# EAGLE design Layer 3 (EAGLE 9.6.2)

## Sheet 1 of 5
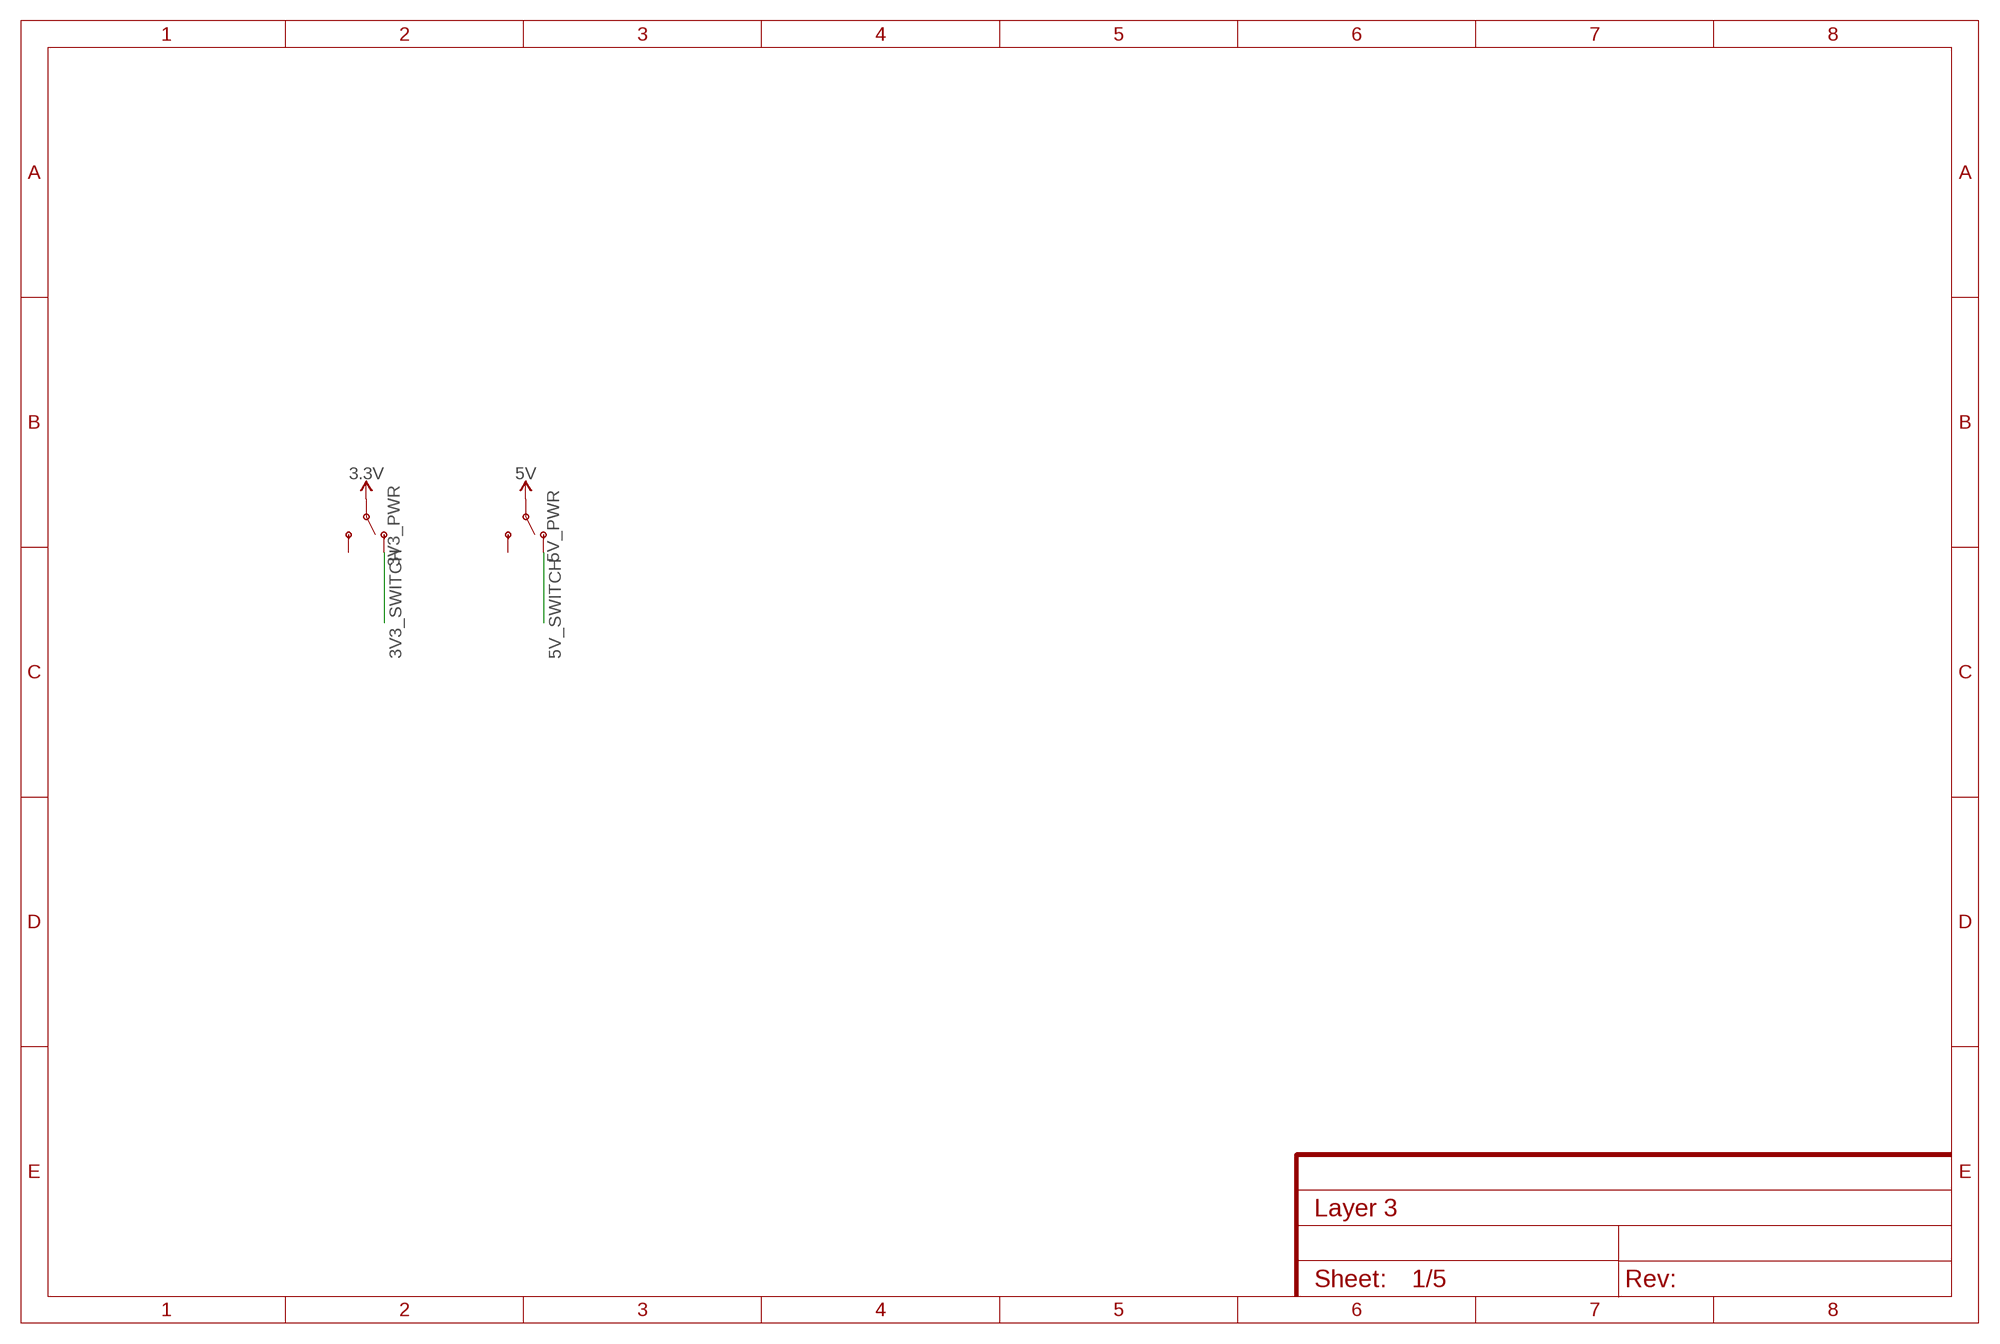
[diagram p0: schematic, sheet 1]

### Parts
3V3_PWR  SWITCH-SPDT-PTH-11.6X4.0MM-LOCK  [SWITCH_SPDT_PTH_11.6X4.0MM_LOCK]
5V_PWR  SWITCH-SPDT-PTH-11.6X4.0MM-LOCK  [SWITCH_SPDT_PTH_11.6X4.0MM_LOCK]

### Nets
3.3V: 3V3_PWR.2(P) ; also sheet 4,5
3V3_SWITCH: 3V3_PWR.1(O) ; also sheet 2,3,4
5V: 5V_PWR.2(P) ; also sheet 4,5
5V_SWITCH: 5V_PWR.1(O) ; also sheet 4
Unconnected: 3V3_PWR.3(S) 5V_PWR.3(S)

## Sheet 2 of 5
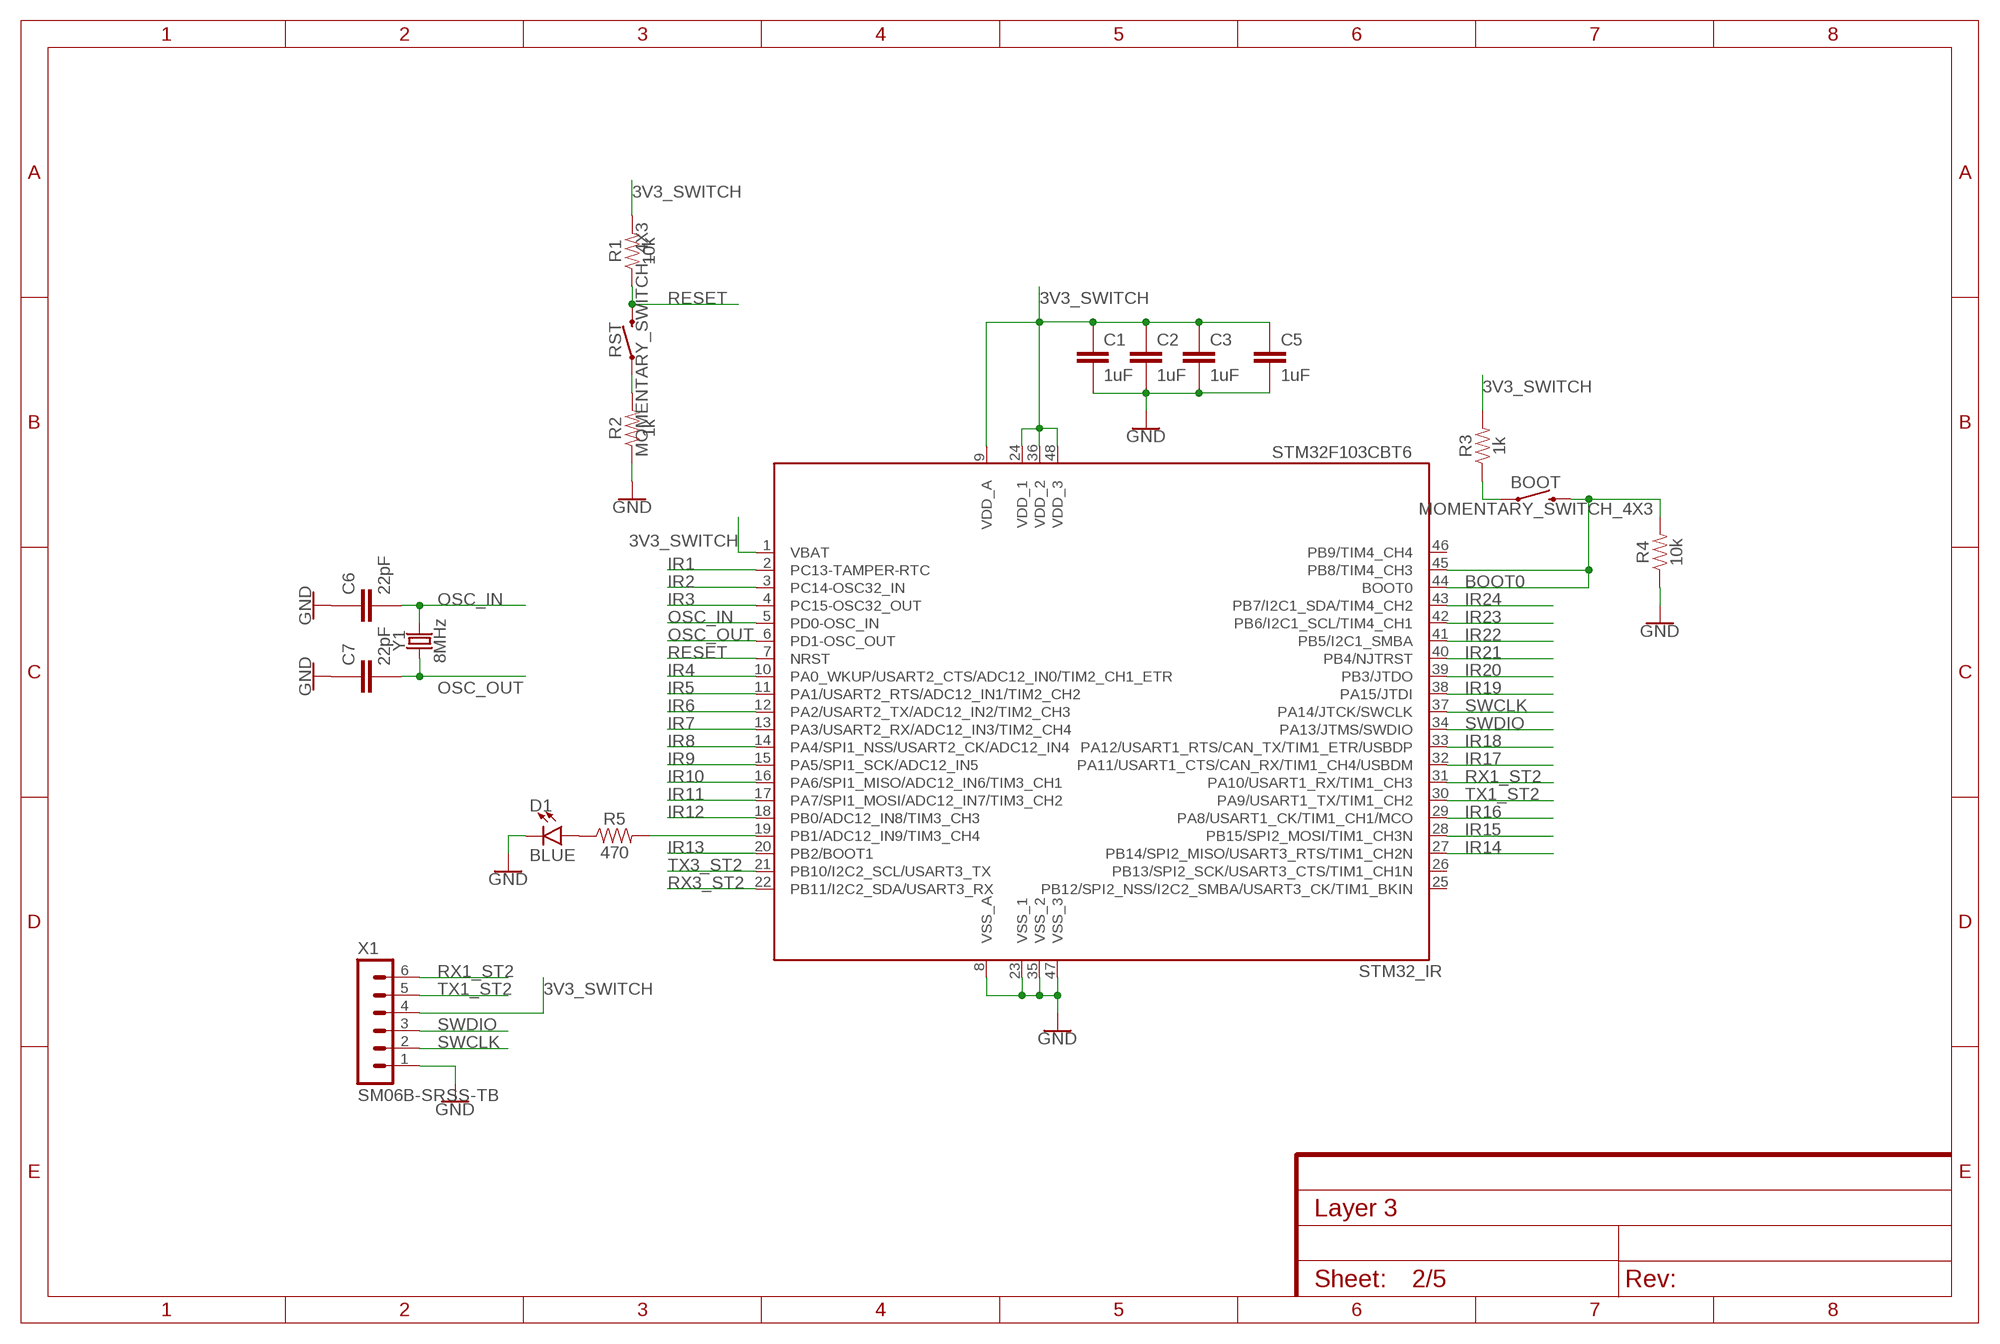
[diagram p1: schematic, sheet 2]

### Parts
BOOT  MOMENTARY_SWITCH_4X3  [MOMENTARY_SWITCH_4X3]
C1  1uF  CAPACITOR0603  [C0603]
C2  1uF  CAPACITOR0603  [C0603]
C3  1uF  CAPACITOR0603  [C0603]
C5  1uF  CAPACITOR0603  [C0603]
C6  22pF  CAPACITOR0603  [C0603]
C7  22pF  CAPACITOR0603  [C0603]
D1  BLUE  LED0603  [LED-0603]
R1  10k  RESISTOR0603  [R0603]
R2  1k  RESISTOR0603  [R0603]
R3  1k  RESISTOR0603  [R0603]
R4  10k  RESISTOR0603  [R0603]
R5  470  RESISTOR0603  [R0603]
RST  MOMENTARY_SWITCH_4X3  [MOMENTARY_SWITCH_4X3]
STM32_IR  STM32F103CBT6  [LQFP48]
X1  SM06B-SRSS-TB  [SM06B-SRSS-TB]
Y1  8MHz  CRYSTALSMD-5X3.2-2PAD  [CRYSTAL-SMD-5X3.2-2PAD]

### Nets
3V3_SWITCH: C1.1 C2.1 C3.1 C5.2 R1.2 R3.2 STM32_IR.1(VBAT) STM32_IR.9(VDD_A) STM32_IR.24(VDD_1) STM32_IR.36(VDD_2) STM32_IR.48(VDD_3) X1.4 ; also sheet 1,3,4
BOOT0: BOOT.P$2 R4.2 STM32_IR.44(BOOT0) STM32_IR.45(PB8/TIM4_CH3)
GND: C1.2 C2.2 C3.2 C5.1 C6.1 C7.1 D1.C R2.1 R4.1 STM32_IR.8(VSS_A) STM32_IR.23(VSS_1) STM32_IR.35(VSS_2) STM32_IR.47(VSS_3) X1.1 ; also sheet 3,4,5
IR1: STM32_IR.2(PC13-TAMPER-RTC) ; also sheet 3
IR2: STM32_IR.3(PC14-OSC32_IN) ; also sheet 3
IR3: STM32_IR.4(PC15-OSC32_OUT) ; also sheet 3
IR4: STM32_IR.10(PA0_WKUP/USART2_CTS/ADC12_IN0/TIM2_CH1_ETR) ; also sheet 3
IR5: STM32_IR.11(PA1/USART2_RTS/ADC12_IN1/TIM2_CH2) ; also sheet 3
IR6: STM32_IR.12(PA2/USART2_TX/ADC12_IN2/TIM2_CH3) ; also sheet 3
IR7: STM32_IR.13(PA3/USART2_RX/ADC12_IN3/TIM2_CH4) ; also sheet 3
IR8: STM32_IR.14(PA4/SPI1_NSS/USART2_CK/ADC12_IN4) ; also sheet 3
IR9: STM32_IR.15(PA5/SPI1_SCK/ADC12_IN5) ; also sheet 3
IR10: STM32_IR.16(PA6/SPI1_MISO/ADC12_IN6/TIM3_CH1) ; also sheet 3
IR11: STM32_IR.17(PA7/SPI1_MOSI/ADC12_IN7/TIM3_CH2) ; also sheet 3
IR12: STM32_IR.18(PB0/ADC12_IN8/TIM3_CH3) ; also sheet 3
IR13: STM32_IR.20(PB2/BOOT1) ; also sheet 3
IR14: STM32_IR.27(PB14/SPI2_MISO/USART3_RTS/TIM1_CH2N) ; also sheet 3
IR15: STM32_IR.28(PB15/SPI2_MOSI/TIM1_CH3N) ; also sheet 3
IR16: STM32_IR.29(PA8/USART1_CK/TIM1_CH1/MCO) ; also sheet 3
IR17: STM32_IR.32(PA11/USART1_CTS/CAN_RX/TIM1_CH4/USBDM) ; also sheet 3
IR18: STM32_IR.33(PA12/USART1_RTS/CAN_TX/TIM1_ETR/USBDP) ; also sheet 3
IR19: STM32_IR.38(PA15/JTDI) ; also sheet 3
IR20: STM32_IR.39(PB3/JTDO) ; also sheet 3
IR21: STM32_IR.40(PB4/NJTRST) ; also sheet 3
IR22: STM32_IR.41(PB5/I2C1_SMBA) ; also sheet 3
IR23: STM32_IR.42(PB6/I2C1_SCL/TIM4_CH1) ; also sheet 3
IR24: STM32_IR.43(PB7/I2C1_SDA/TIM4_CH2) ; also sheet 3
N$70: R2.2 RST.P$1
N$72: BOOT.P$1 R3.1
N$73: R5.2 STM32_IR.19(PB1/ADC12_IN9/TIM3_CH4)
N$74: D1.A R5.1
OSC_IN: C6.2 STM32_IR.5(PD0-OSC_IN) Y1.P$2
OSC_OUT: C7.2 STM32_IR.6(PD1-OSC_OUT) Y1.P$1
RESET: R1.1 RST.P$2 STM32_IR.7(NRST)
RX1_ST2: STM32_IR.31(PA10/USART1_RX/TIM1_CH3) X1.6 ; also sheet 4
RX3_ST2: STM32_IR.22(PB11/I2C2_SDA/USART3_RX)
SWCLK: STM32_IR.37(PA14/JTCK/SWCLK) X1.2
SWDIO: STM32_IR.34(PA13/JTMS/SWDIO) X1.3
TX1_ST2: STM32_IR.30(PA9/USART1_TX/TIM1_CH2) X1.5 ; also sheet 4
TX3_ST2: STM32_IR.21(PB10/I2C2_SCL/USART3_TX)
Unconnected: STM32_IR.25(PB12/SPI2_NSS/I2C2_SMBA/USART3_CK/TIM1_BKIN) STM32_IR.26(PB13/SPI2_SCK/USART3_CTS/TIM1_CH1N) STM32_IR.46(PB9/TIM4_CH4)

## Sheet 3 of 5
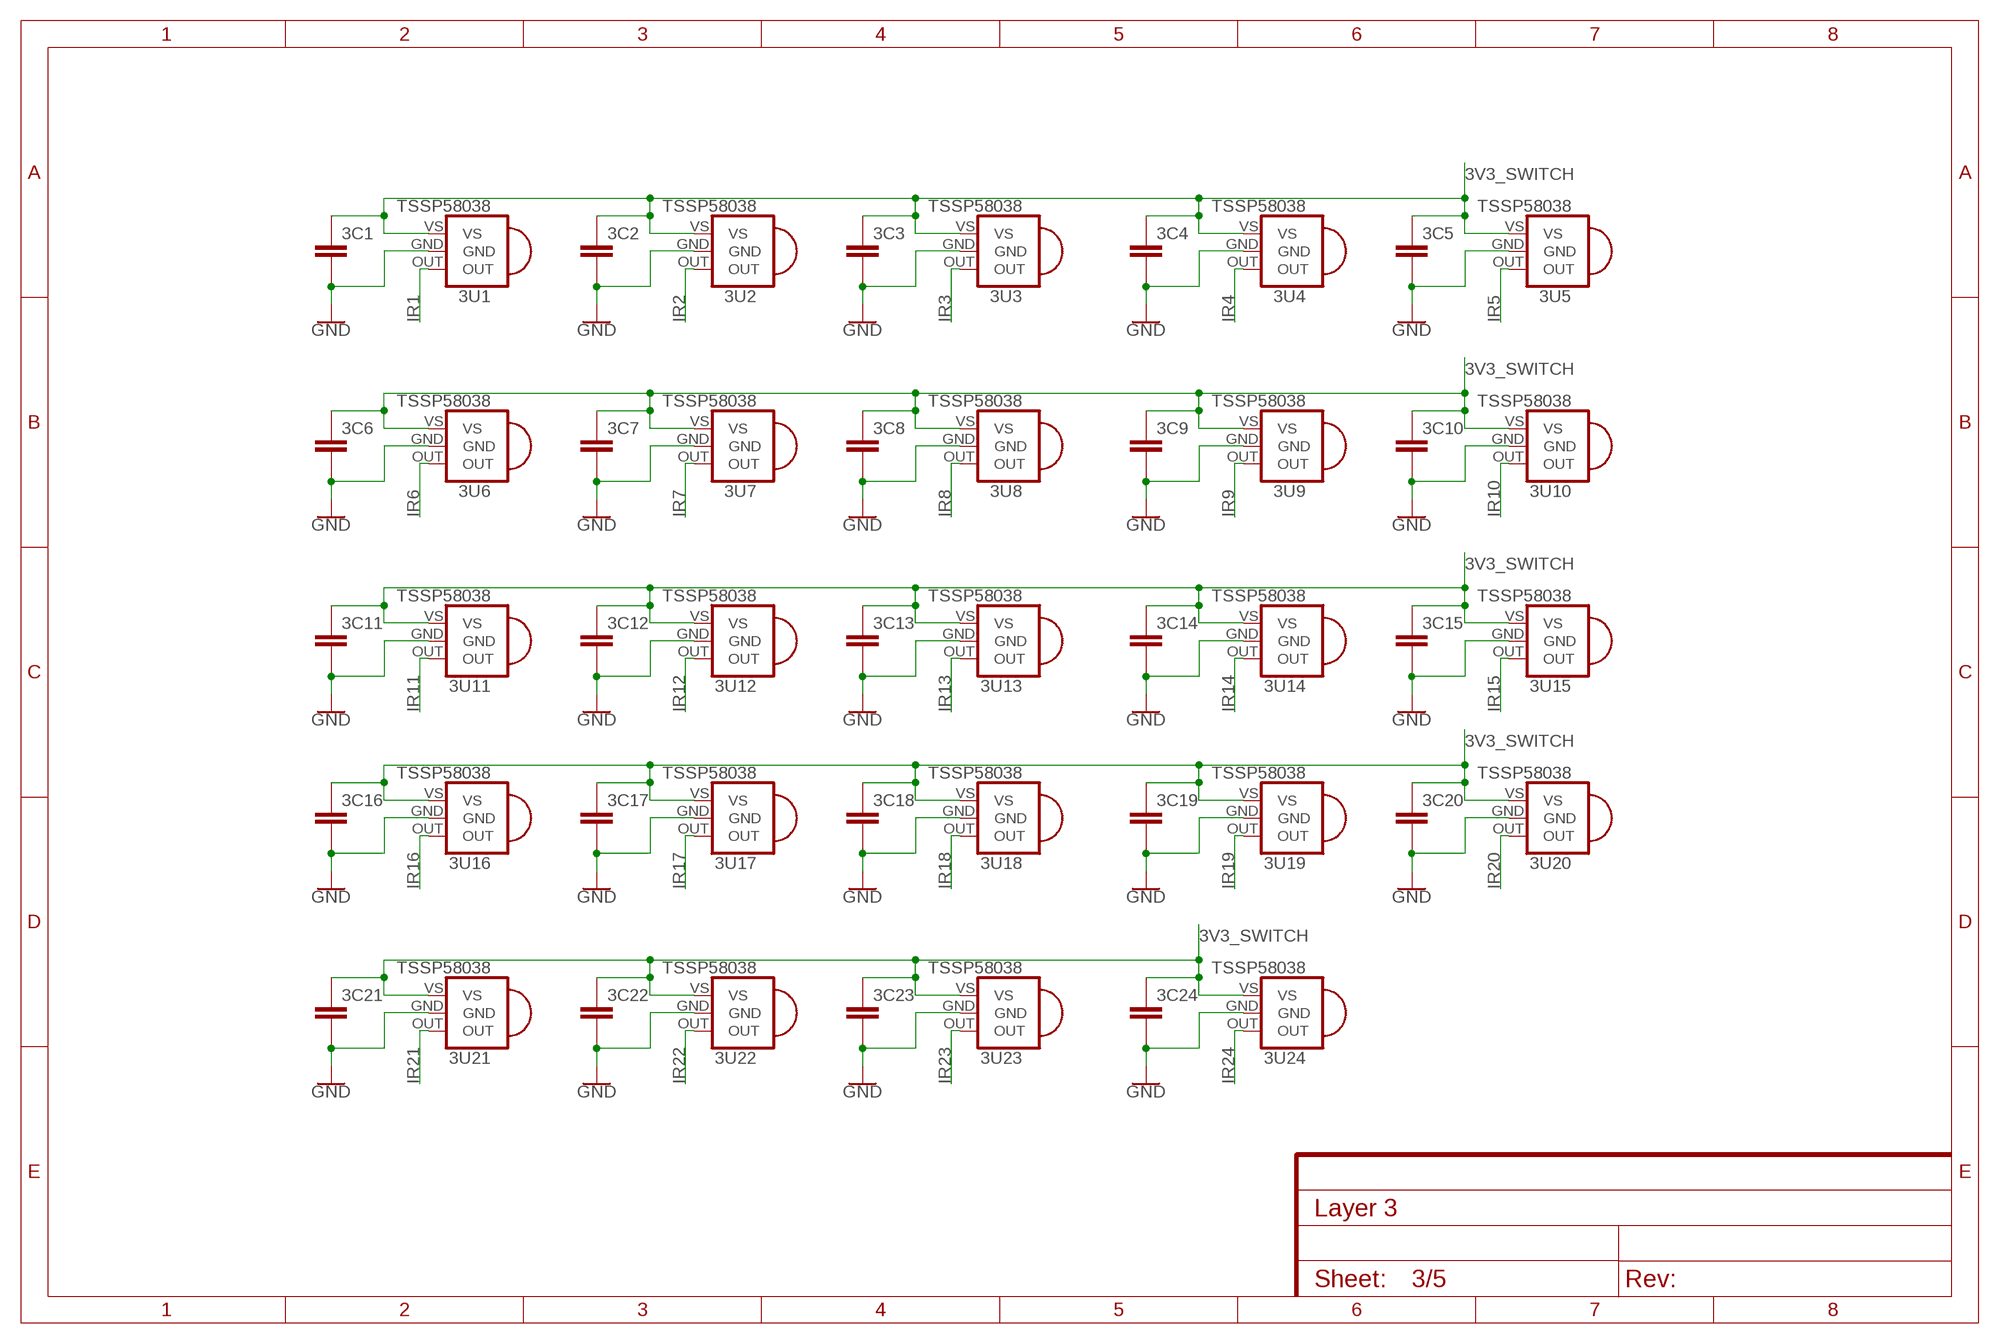
[diagram p2: schematic, sheet 3]

### Parts
3C1  CAPACITOR0603  [C0603]
3C2  CAPACITOR0603  [C0603]
3C3  CAPACITOR0603  [C0603]
3C4  CAPACITOR0603  [C0603]
3C5  CAPACITOR0603  [C0603]
3C6  CAPACITOR0603  [C0603]
3C7  CAPACITOR0603  [C0603]
3C8  CAPACITOR0603  [C0603]
3C9  CAPACITOR0603  [C0603]
3C10  CAPACITOR0603  [C0603]
3C11  CAPACITOR0603  [C0603]
3C12  CAPACITOR0603  [C0603]
3C13  CAPACITOR0603  [C0603]
3C14  CAPACITOR0603  [C0603]
3C15  CAPACITOR0603  [C0603]
3C16  CAPACITOR0603  [C0603]
3C17  CAPACITOR0603  [C0603]
3C18  CAPACITOR0603  [C0603]
3C19  CAPACITOR0603  [C0603]
3C20  CAPACITOR0603  [C0603]
3C21  CAPACITOR0603  [C0603]
3C22  CAPACITOR0603  [C0603]
3C23  CAPACITOR0603  [C0603]
3C24  CAPACITOR0603  [C0603]
3U1  TSSP58038  [TSSP58038]
3U2  TSSP58038  [TSSP58038]
3U3  TSSP58038  [TSSP58038]
3U4  TSSP58038  [TSSP58038]
3U5  TSSP58038  [TSSP58038]
3U6  TSSP58038  [TSSP58038]
3U7  TSSP58038  [TSSP58038]
3U8  TSSP58038  [TSSP58038]
3U9  TSSP58038  [TSSP58038]
3U10  TSSP58038  [TSSP58038]
3U11  TSSP58038  [TSSP58038]
3U12  TSSP58038  [TSSP58038]
3U13  TSSP58038  [TSSP58038]
3U14  TSSP58038  [TSSP58038]
3U15  TSSP58038  [TSSP58038]
3U16  TSSP58038  [TSSP58038]
3U17  TSSP58038  [TSSP58038]
3U18  TSSP58038  [TSSP58038]
3U19  TSSP58038  [TSSP58038]
3U20  TSSP58038  [TSSP58038]
3U21  TSSP58038  [TSSP58038]
3U22  TSSP58038  [TSSP58038]
3U23  TSSP58038  [TSSP58038]
3U24  TSSP58038  [TSSP58038]

### Nets
3V3_SWITCH: 3C1.1 3C2.1 3C3.1 3C4.1 3C5.1 3C6.1 3C7.1 3C8.1 3C9.1 3C10.1 3C11.1 3C12.1 3C13.1 3C14.1 3C15.1 3C16.1 3C17.1 3C18.1 3C19.1 3C20.1 3C21.1 3C22.1 3C23.1 3C24.1 3U1.VS 3U2.VS 3U3.VS 3U4.VS 3U5.VS 3U6.VS 3U7.VS 3U8.VS 3U9.VS 3U10.VS 3U11.VS 3U12.VS 3U13.VS 3U14.VS 3U15.VS 3U16.VS 3U17.VS 3U18.VS 3U19.VS 3U20.VS 3U21.VS 3U22.VS 3U23.VS 3U24.VS ; also sheet 1,2,4
GND: 3C1.2 3C2.2 3C3.2 3C4.2 3C5.2 3C6.2 3C7.2 3C8.2 3C9.2 3C10.2 3C11.2 3C12.2 3C13.2 3C14.2 3C15.2 3C16.2 3C17.2 3C18.2 3C19.2 3C20.2 3C21.2 3C22.2 3C23.2 3C24.2 3U1.GND 3U2.GND 3U3.GND 3U4.GND 3U5.GND 3U6.GND 3U7.GND 3U8.GND 3U9.GND 3U10.GND 3U11.GND 3U12.GND 3U13.GND 3U14.GND 3U15.GND 3U16.GND 3U17.GND 3U18.GND 3U19.GND 3U20.GND 3U21.GND 3U22.GND 3U23.GND 3U24.GND ; also sheet 2,4,5
IR1: 3U1.OUT ; also sheet 2
IR2: 3U2.OUT ; also sheet 2
IR3: 3U3.OUT ; also sheet 2
IR4: 3U4.OUT ; also sheet 2
IR5: 3U5.OUT ; also sheet 2
IR6: 3U6.OUT ; also sheet 2
IR7: 3U7.OUT ; also sheet 2
IR8: 3U8.OUT ; also sheet 2
IR9: 3U9.OUT ; also sheet 2
IR10: 3U10.OUT ; also sheet 2
IR11: 3U11.OUT ; also sheet 2
IR12: 3U12.OUT ; also sheet 2
IR13: 3U13.OUT ; also sheet 2
IR14: 3U14.OUT ; also sheet 2
IR15: 3U15.OUT ; also sheet 2
IR16: 3U16.OUT ; also sheet 2
IR17: 3U17.OUT ; also sheet 2
IR18: 3U18.OUT ; also sheet 2
IR19: 3U19.OUT ; also sheet 2
IR20: 3U20.OUT ; also sheet 2
IR21: 3U21.OUT ; also sheet 2
IR22: 3U22.OUT ; also sheet 2
IR23: 3U23.OUT ; also sheet 2
IR24: 3U24.OUT ; also sheet 2

## Sheet 4 of 5
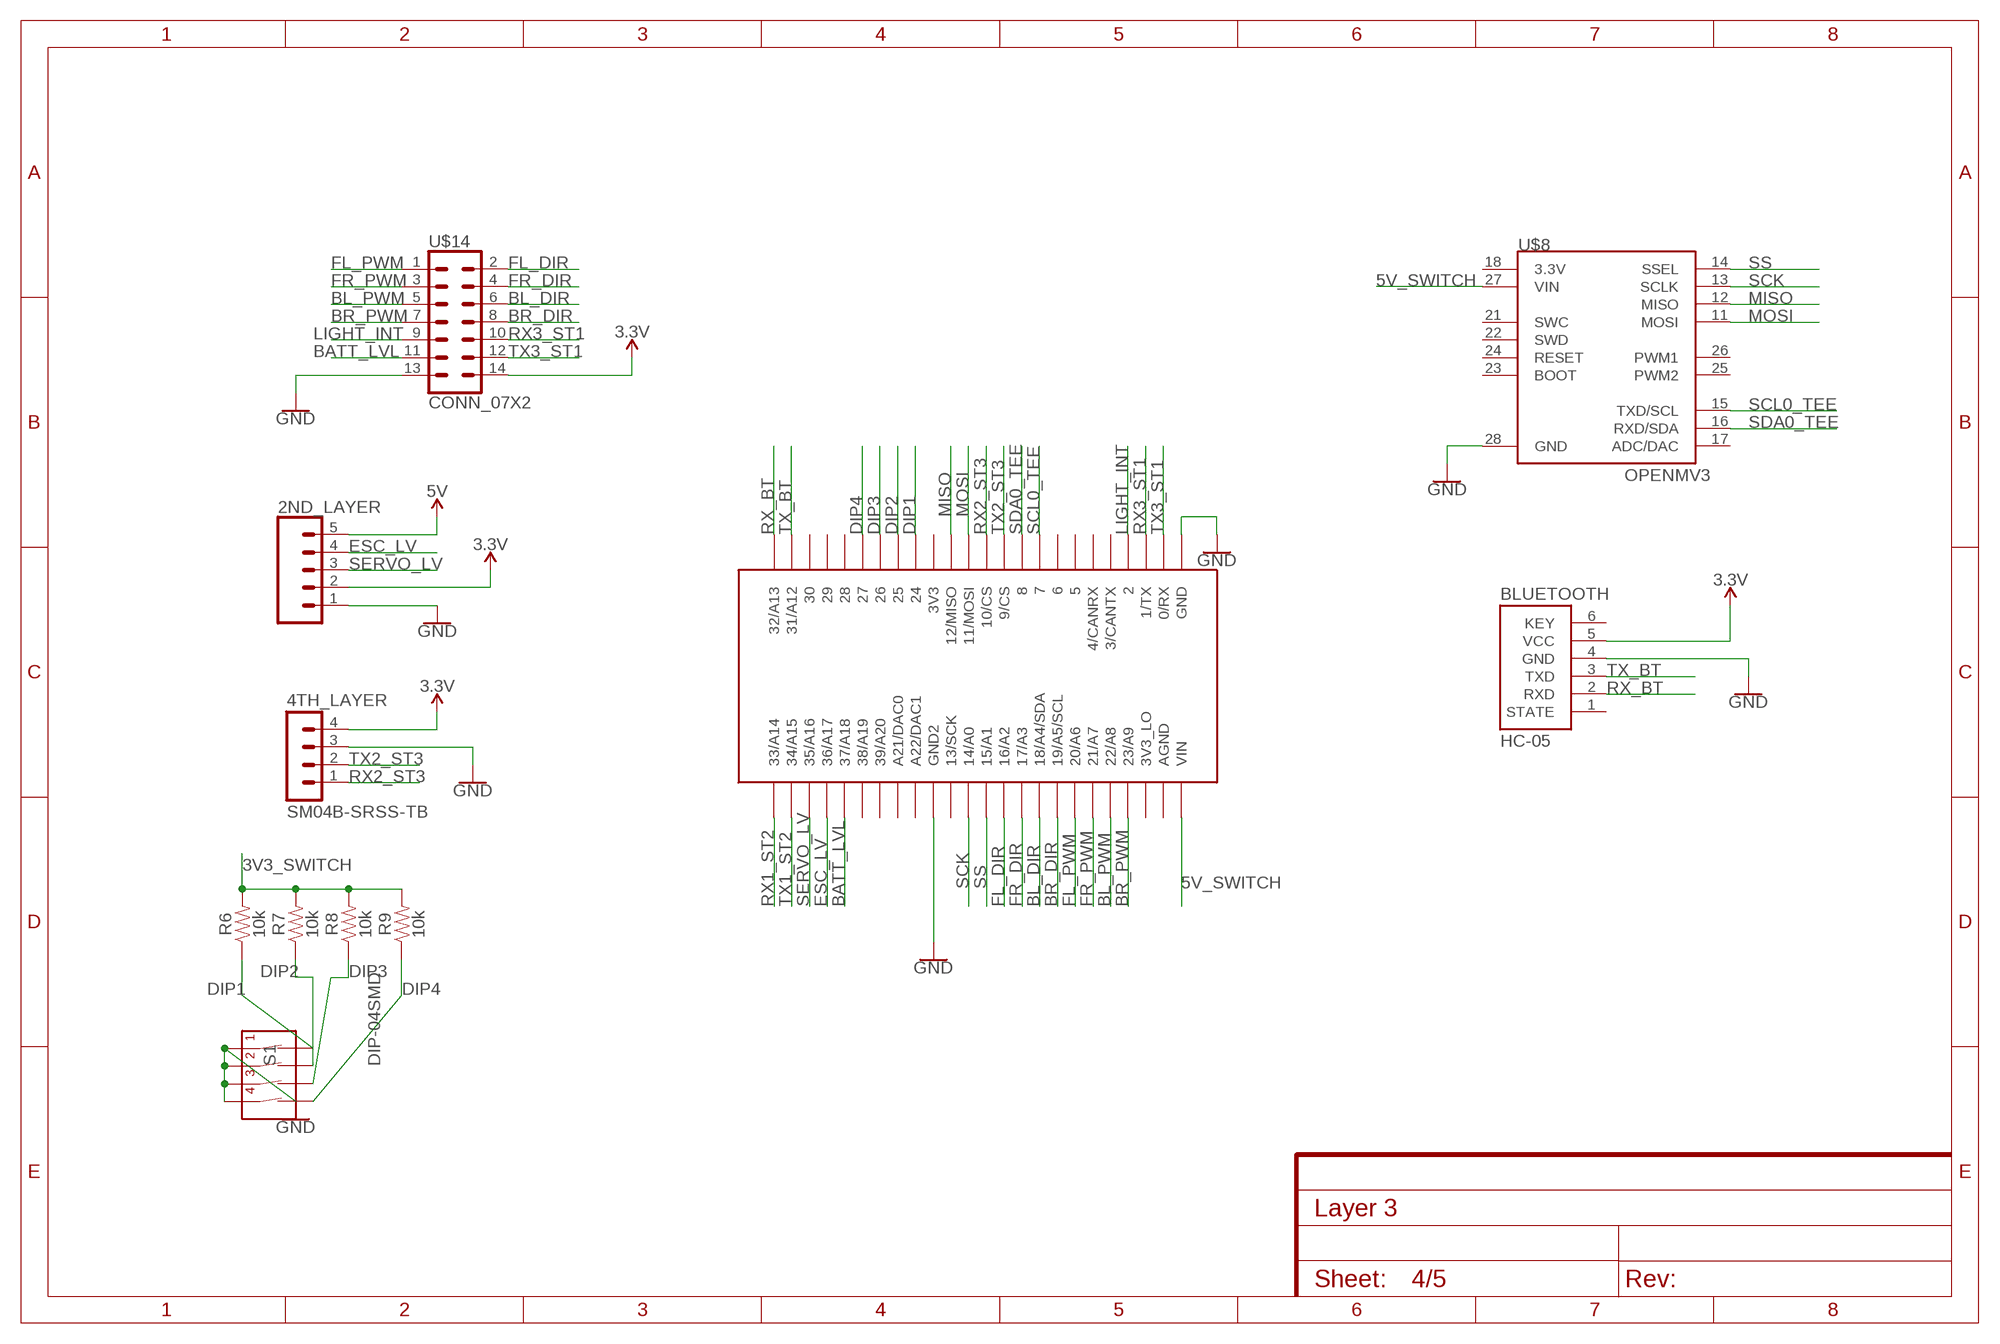
[diagram p3: schematic, sheet 4]

### Parts
2ND_LAYER  CONN_05LOCK  [1X05_LOCK]
4TH_LAYER  SM04B-SRSS-TB  [SM04B-SRSS-TB]
BLUETOOTH  HC-05  [HC-05]
R6  10k  RESISTOR0603  [R0603]
R7  10k  RESISTOR0603  [R0603]
R8  10k  RESISTOR0603  [R0603]
R9  10k  RESISTOR0603  [R0603]
S1  DIP-04SMD  [DIPSWITCH-04-SMD]
U$1  TEENSY_3.5/3.6_NO_MIDDLE  [TEENSY_3.5/3.6_NO_MIDDLE]
U$8  OPENMV3  [OPENMV3]
U$14  CONN_07X2  [2X7]

### Nets
3.3V: 2ND_LAYER.2 4TH_LAYER.4 BLUETOOTH.5(VCC) U$14.14 ; also sheet 1,5
3V3_SWITCH: R6.2 R7.2 R8.2 R9.2 ; also sheet 1,2,3
5V: 2ND_LAYER.5 ; also sheet 1,5
5V_SWITCH: U$1.VIN U$8.27(VIN) ; also sheet 1
BATT_LVL: U$1.37/A18 U$14.11
BL_DIR: U$1.18/A4/SDA U$14.6
BL_PWM: U$1.22/A8 U$14.5
BR_DIR: U$1.19/A5/SCL U$14.8
BR_PWM: U$1.23/A9 U$14.7
DIP1: R6.1 S1.1(1A) U$1.24
DIP2: R7.1 S1.2(2A) U$1.25
DIP3: R8.1 S1.3(3A) U$1.26
DIP4: R9.1 S1.4(4A) U$1.27
ESC_LV: 2ND_LAYER.4 U$1.36/A17 ; also sheet 5
FL_DIR: U$1.16/A2 U$14.2
FL_PWM: U$1.20/A6 U$14.1
FR_DIR: U$1.17/A3 U$14.4
FR_PWM: U$1.21/A7 U$14.3
GND: 2ND_LAYER.1 4TH_LAYER.3 BLUETOOTH.4(GND) S1.5(4B) S1.6(3B) S1.7(2B) S1.8(1B) U$1.GND2 U$8.28(GND) U$14.13 ; also sheet 2,3,5
LIGHT_INT: U$1.2 U$14.9
MISO: U$1.12/MISO U$8.12(MISO)
MOSI: U$1.11/MOSI U$8.11(MOSI)
N$1: U$1.GND ; supply symbol labelled GND
RX1_ST2: U$1.33/A14 ; also sheet 2
RX2_ST3: 4TH_LAYER.1 U$1.10/CS
RX3_ST1: U$1.1/TX U$14.10
RX_BT: BLUETOOTH.2(RXD) U$1.32/A13
SCK: U$1.14/A0 U$8.13(SCLK)
SCL0_TEE: U$1.7 U$8.15(TXD/SCL)
SDA0_TEE: U$1.8 U$8.16(RXD/SDA)
SERVO_LV: 2ND_LAYER.3 U$1.35/A16 ; also sheet 5
SS: U$1.15/A1 U$8.14(SSEL)
TX1_ST2: U$1.34/A15 ; also sheet 2
TX2_ST3: 4TH_LAYER.2 U$1.9/CS
TX3_ST1: U$1.0/RX U$14.12
TX_BT: BLUETOOTH.3(TXD) U$1.31/A12
Unconnected: BLUETOOTH.1(STATE) BLUETOOTH.6(KEY) U$1.3/CANTX U$1.3V3 U$1.3V3_LO U$1.4/CANRX U$1.5 U$1.6 U$1.13/SCK U$1.28 U$1.29 U$1.30 U$1.38/A19 U$1.39/A20 U$1.A21/DAC0 U$1.A22/DAC1 U$1.AGND U$8.17(ADC/DAC) U$8.18(3.3V) U$8.21(SWC) U$8.22(SWD) U$8.23(BOOT) U$8.24(RESET) U$8.25(PWM2) U$8.26(PWM1)

## Sheet 5 of 5: ESC + Servo
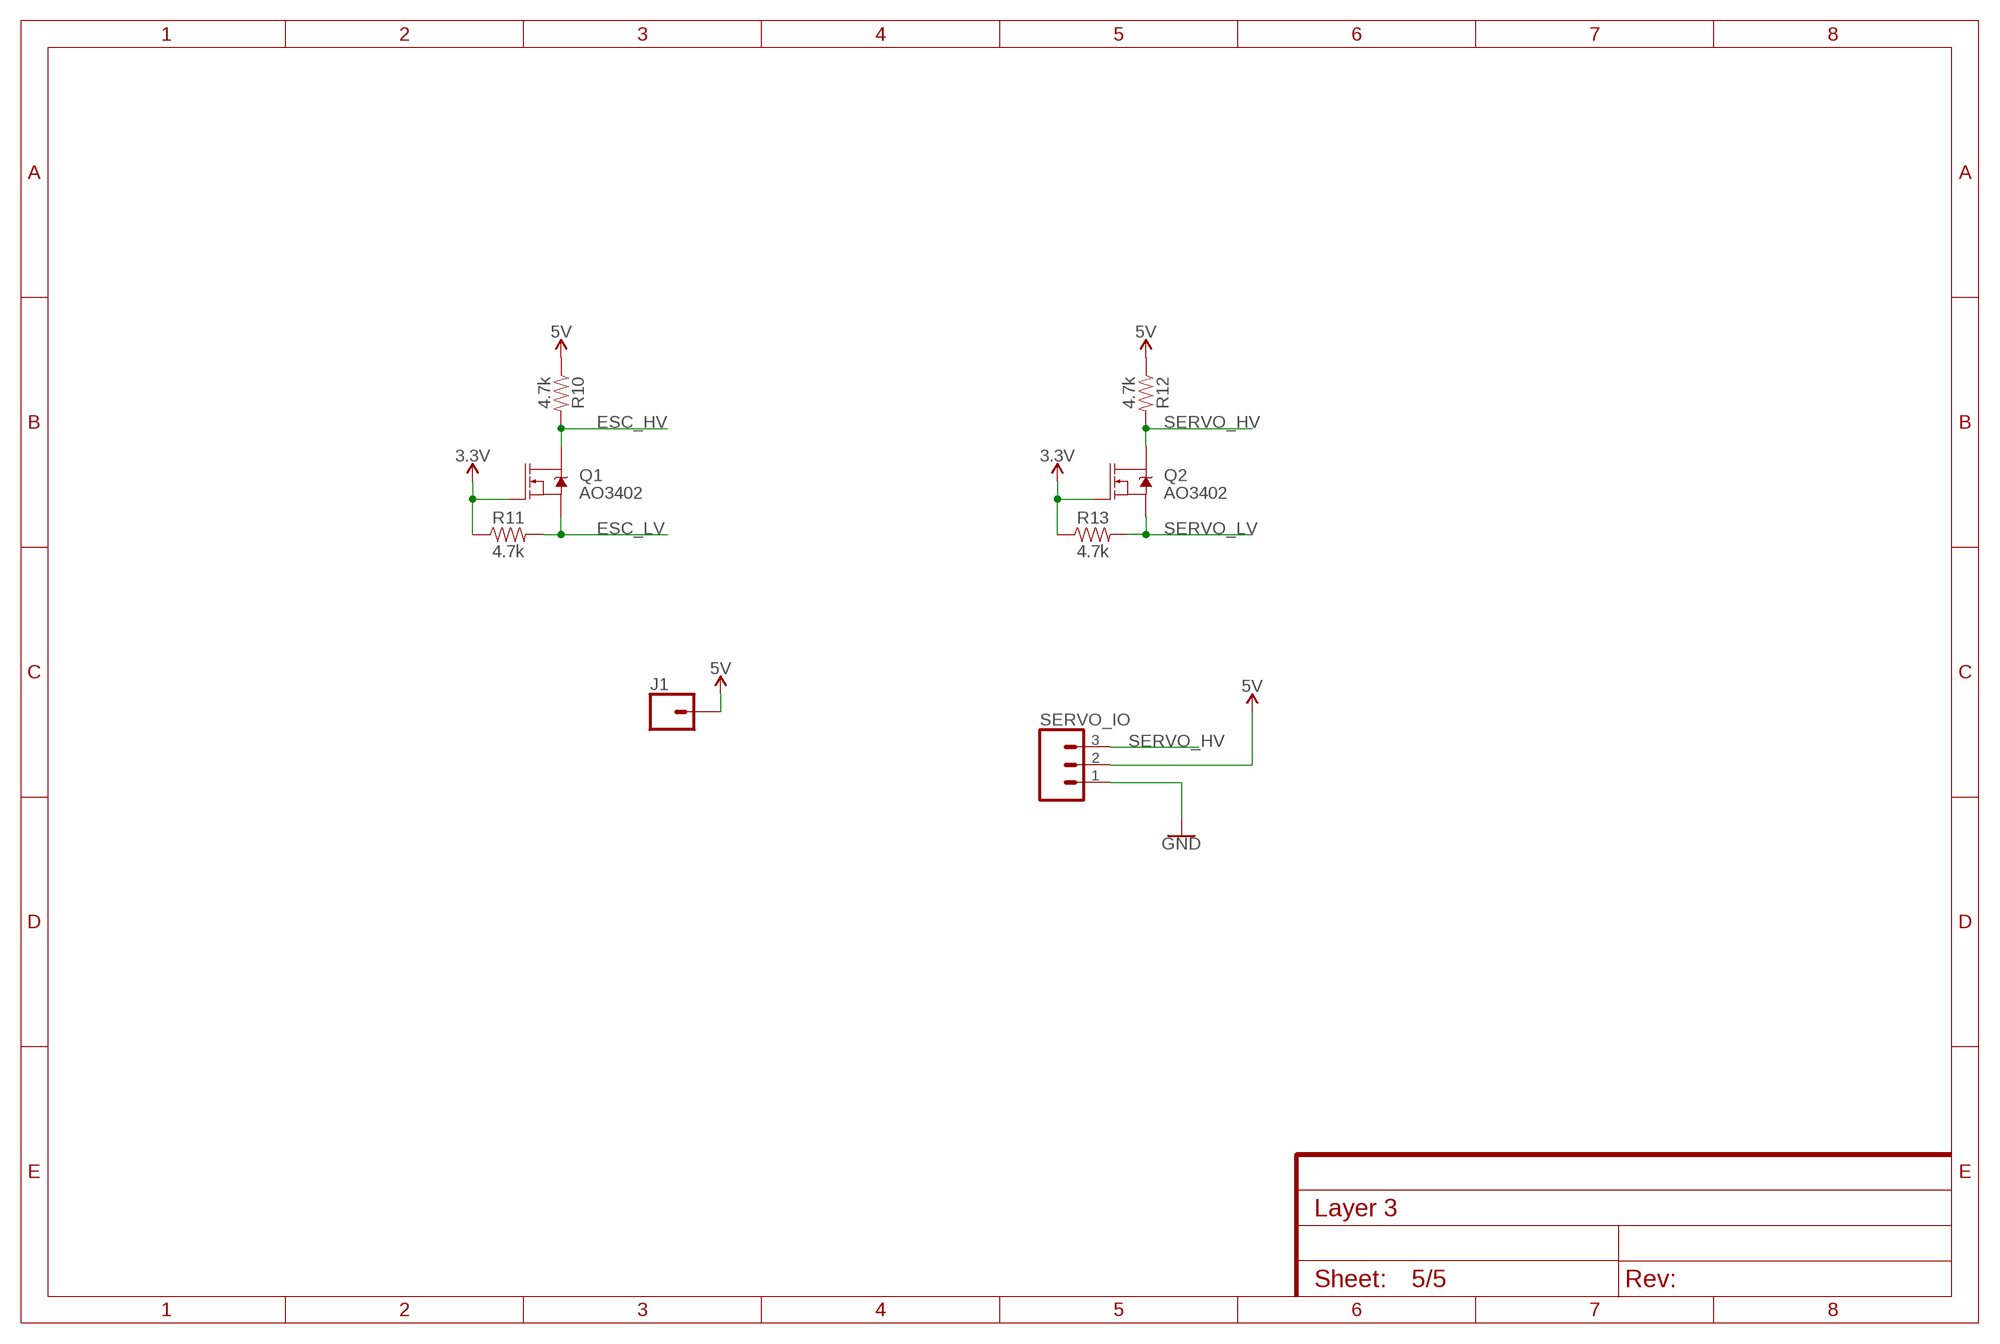
[diagram p4: schematic, sheet 5]

### Parts
J1  CONN_01  [1X01]
Q1  AO3402  MOSFET-NCH-AO3404A  [SOT23-3]
Q2  AO3402  MOSFET-NCH-AO3404A  [SOT23-3]
R10  4.7k  RESISTOR0603  [R0603]
R11  4.7k  RESISTOR0603  [R0603]
R12  4.7k  RESISTOR0603  [R0603]
R13  4.7k  RESISTOR0603  [R0603]
SERVO_IO  CONN_03LOCK  [1X03_LOCK]

### Nets
3.3V: Q1.1(G) Q2.1(G) R11.1 R13.1 ; also sheet 1,4
5V: J1.1 R10.1 R12.1 SERVO_IO.2 ; also sheet 1,4
ESC_HV: Q1.3(D) R10.2
ESC_LV: Q1.2(S) R11.2 ; also sheet 4
GND: SERVO_IO.1 ; also sheet 2,3,4
SERVO_HV: Q2.3(D) R12.2 SERVO_IO.3
SERVO_LV: Q2.2(S) R13.2 ; also sheet 4

## Library data of the parts
2ND_LAYER = SparkFun-Connectors:CONN_05: Multi connection point. Often used as Generic Header-pin footprint for 0.1 inch spaced/style header connections On any of the 0.1 inch spaced packages, you can populate with these: Break Away Headers - Straight <https://www.sparkfun.com/products/116> (PRT-00116) Break Away Male Headers - Right Angle <https://www.sparkfun.com/products/553> (PRT-00553) Female Headers <https://www.sparkfun.com/products/115> (PRT-00115) Break Away Headers - Machine Pin <https://www.sparkfun.com/products/117> (PRT-00117) Break Away Female Headers - Swiss Machine Pin <https://www.sparkfun.com/products/743> (PRT-00743) For SCREWTERMINALS and SPRING TERMINALS visit here: Screw Terimnals on SparkFun.com <https://www.sparkfun.com/search/results?term=Screw+Terminals> (5mm/3.5mm/2.54mm spacing) This device is also useful as a general connection point to wire up your design to another part of your project. Our various solder wires solder well into these plated through hole pads. Hook-Up Wire - Assortment (Stranded, 22 AWG) <https://www.sparkfun.com/products/11375> (PRT-11375) Hook-Up Wire - Assortment (Solid Core, 22 AWG) <https://www.sparkfun.com/products/11367> (PRT-11367) View the entire wire category on our website here <https://www.sparkfun.com/categories/141> Special notes: Molex polarized connector foot print use with SKU : PRT-08231 with associated crimp pins and housings. 1MM SMD Version SKU: PRT-10208
3C1-3C24 C1-C3 C5-C7 = JH:CAPACITOR
3U1-3U24 = JH:TSSP58038
3V3_PWR 5V_PWR = SparkFun-Switches:SWITCH-SPDT: Single Pole, Double Throw (SPDT) Switch Single-pole, double-throw (SPDT) switch. Variant Overview SMD-AYZ0202 Surface Mount DPDT Switch <https://www.sparkfun.com/products/597> (COM-00597) Used on e.g. LilyPad Arduino USB - ATmega32U4 Board <https://www.sparkfun.com/products/12049> PTH-11.6X4.0MM SPDT Mini Power Switch <https://www.sparkfun.com/products/102> (COM-00102) Used on e.g. SparkFun Simon Says - Through-Hole Soldering Kit <https://www.sparkfun.com/products/10547> (KIT-10547) PTH-11.6X4.0MM-KIT KIT version of SPDT Mini Power Switch - Simplifies soldering by removing tStop of switch pins - only one side can be soldered. PTH-11.6X4.0MM-LOCK LOCK version of SPDT Mini Power Switch - Offset pins hold switch in place for easier soldering. SMD-RIGHT-ANGLE Surface Mount Right Angle Switch <https://www.sparkfun.com/products/10860> (COM-10860) Used on e.g. SparkFun ESP8266 Thing <https://www.sparkfun.com/products/13231>; PROD_ID: SWCH-08261; SF_SKU: COM-00102
4TH_LAYER = con-JST SH:SM04B-SRSS: JST SH series header 1.00mm pitch disconnectable crimp style connectors, horizontal (side entry type), 4 pins
BLUETOOTH = JH:HC-05
BOOT RST = MY-LIBRARY:MOMENTARY_SWITCH_4X3
D1 = SparkFun-LED:LED: LED (Generic) Standard schematic elements and footprints for 5mm, 3mm, 1206, and 0603 sized LEDs. Generic LEDs with no color specified.
J1 = Connectors:CONN_01: Single connection point. Often used as Generic Header-pin footprint for 0.1 inch spaced/style header connections On any of the 0.1 inch spaced packages, you can populate with these: Break Away Headers - Straight <https://www.sparkfun.com/products/116> (PRT-00116) Break Away Male Headers - Right Angle <https://www.sparkfun.com/products/553> (PRT-00553) Female Headers <https://www.sparkfun.com/products/115> (PRT-00115) Break Away Headers - Machine Pin <https://www.sparkfun.com/products/117> (PRT-00117) Break Away Female Headers - Swiss Machine Pin <https://www.sparkfun.com/products/743> (PRT-00743) This device is also useful as a general connection point to wire up your design to another part of your project. Our various solder wires solder well into these plated through hole pads. Hook-Up Wire - Assortment (Stranded, 22 AWG) <https://www.sparkfun.com/products/11375> (PRT-11375) Hook-Up Wire - Assortment (Solid Core, 22 AWG) <https://www.sparkfun.com/products/11367> (PRT-11367) View the entire wire category on our website here <https://www.sparkfun.com/categories/141> Special notes: SMTSO-256-ET is a "flush mount" nut for a 4-40 screw. We mostly use this on specialty testbeds; it is a nice way to connect hardware to your PCB at an adjustable hieght. Also note, the SNAP packages are for using a snappable style connector. We sell a baggie of snaps and they are also used on two LilyPad designs: Snap Assortment - 30 pack (male and female) <https://www.sparkfun.com/products/11347> (DEV-11347) LilyPad Arduino SimpleSnap <https://www.sparkfun.com/products/10941> (DEV-10941) LilyPad SimpleSnap Protoboard <https://www.sparkfun.com/products/10940> (DEV-10940)
Q1 Q2 = SparkFun-DiscreteSemi:MOSFET-NCH: N-channel MOSFETs Voltage controlled devices that allow control of high current outputs. SparkFun Products: SparkFun OpenScale <https://www.sparkfun.com/products/13261> SparkFun Digital Sandbox <https://www.sparkfun.com/products/12651> SparkFun Monster Moto Shield <https://www.sparkfun.com/products/10182> SparkFun MOSFET Power Controller <https://www.sparkfun.com/products/11214>; PROD_ID: TRANS-12988; VALUE: 5.8A/30V/35mΩ
R1-R13 = JH:RESISTOR
S1 = SparkFun-Switches:DIP-04: 4-Position DIP Switch 4-circuit DIP (dual inline package) switch. Commonly used to physcially set a circuit's behavior. SparkFun Products Prototype Part
SERVO_IO = SparkFun-Connectors:CONN_03: Multi connection point. Often used as Generic Header-pin footprint for 0.1 inch spaced/style header connections On any of the 0.1 inch spaced packages, you can populate with these: Break Away Headers - Straight <https://www.sparkfun.com/products/116> (PRT-00116) Break Away Male Headers - Right Angle <https://www.sparkfun.com/products/553> (PRT-00553) Female Headers <https://www.sparkfun.com/products/115> (PRT-00115) Break Away Headers - Machine Pin <https://www.sparkfun.com/products/117> (PRT-00117) Break Away Female Headers - Swiss Machine Pin <https://www.sparkfun.com/products/743> (PRT-00743) Stackable Header - 3 Pin (Female, 0.1") <https://www.sparkfun.com/products/13875> (PRT-13875) For SCREWTERMINALS and SPRING TERMINALS visit here: Screw Terimnals on SparkFun.com <https://www.sparkfun.com/search/results?term=Screw+Terminals> (5mm/3.5mm/2.54mm spacing) This device is also useful as a general connection point to wire up your design to another part of your project. Our various solder wires solder well into these plated through hole pads. Hook-Up Wire - Assortment (Stranded, 22 AWG) <https://www.sparkfun.com/products/11375> (PRT-11375) Hook-Up Wire - Assortment (Solid Core, 22 AWG) <https://www.sparkfun.com/products/11367> (PRT-11367) View the entire wire category on our website here <https://www.sparkfun.com/categories/141> Special notes: Molex polarized connector foot print use with SKU : PRT-08232 with associated crimp pins and housings.
STM32_IR = JH:STM32F103CBT6
U$1 = JH:TEENSY_3.5/3.6_NO_MIDDLE
U$8 = openmv:OPENMV3
U$14 = MY-LIBRARY:CONN_07X2
X1 = con-JST SH:SM06B-SRSS: JST SH series header 1.00mm pitch disconnectable crimp style connectors, horizontal (side entry type), 6 pins
Y1 = SparkFun-Clocks:CRYSTAL: Crystals (Generic) These are passive quartz crystals, which can be used as a clock source for a microcontroller. Crystal's are two-terminal devices. They require external "load" capacitors to generate an oscillating signal.

## Board
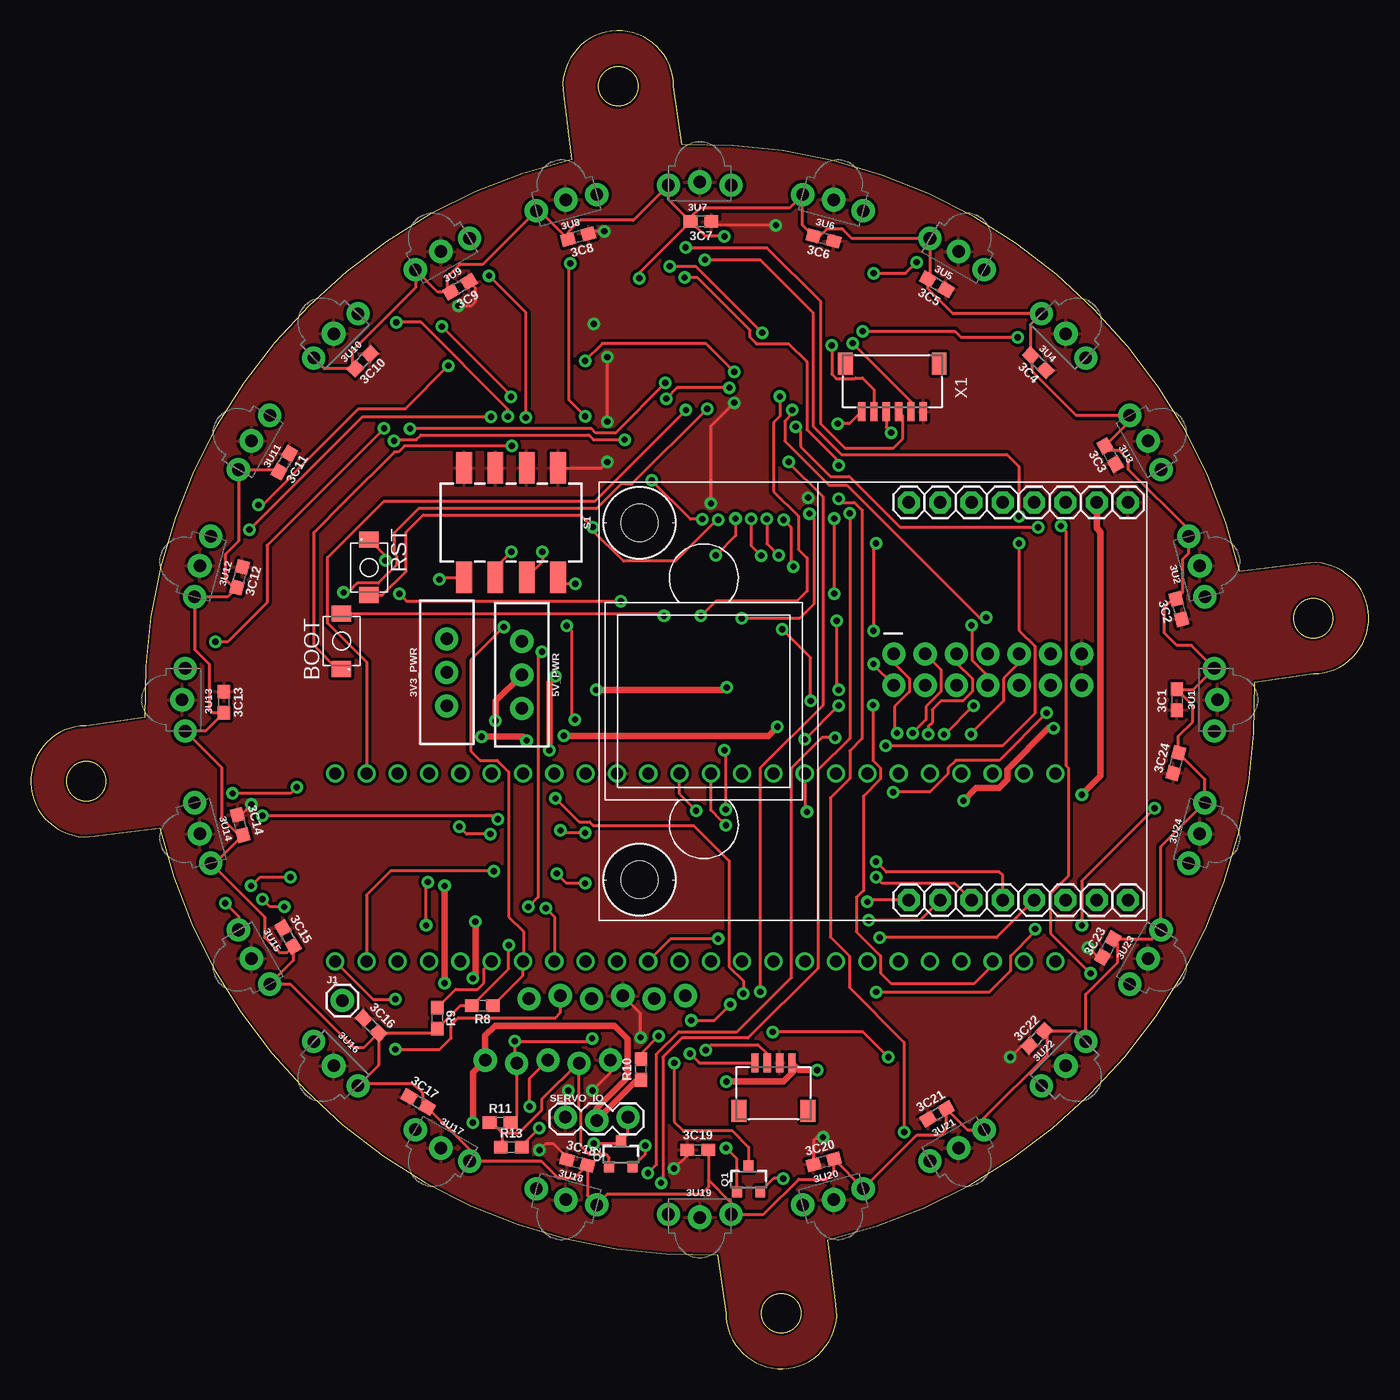
[diagram p5: board, top side]
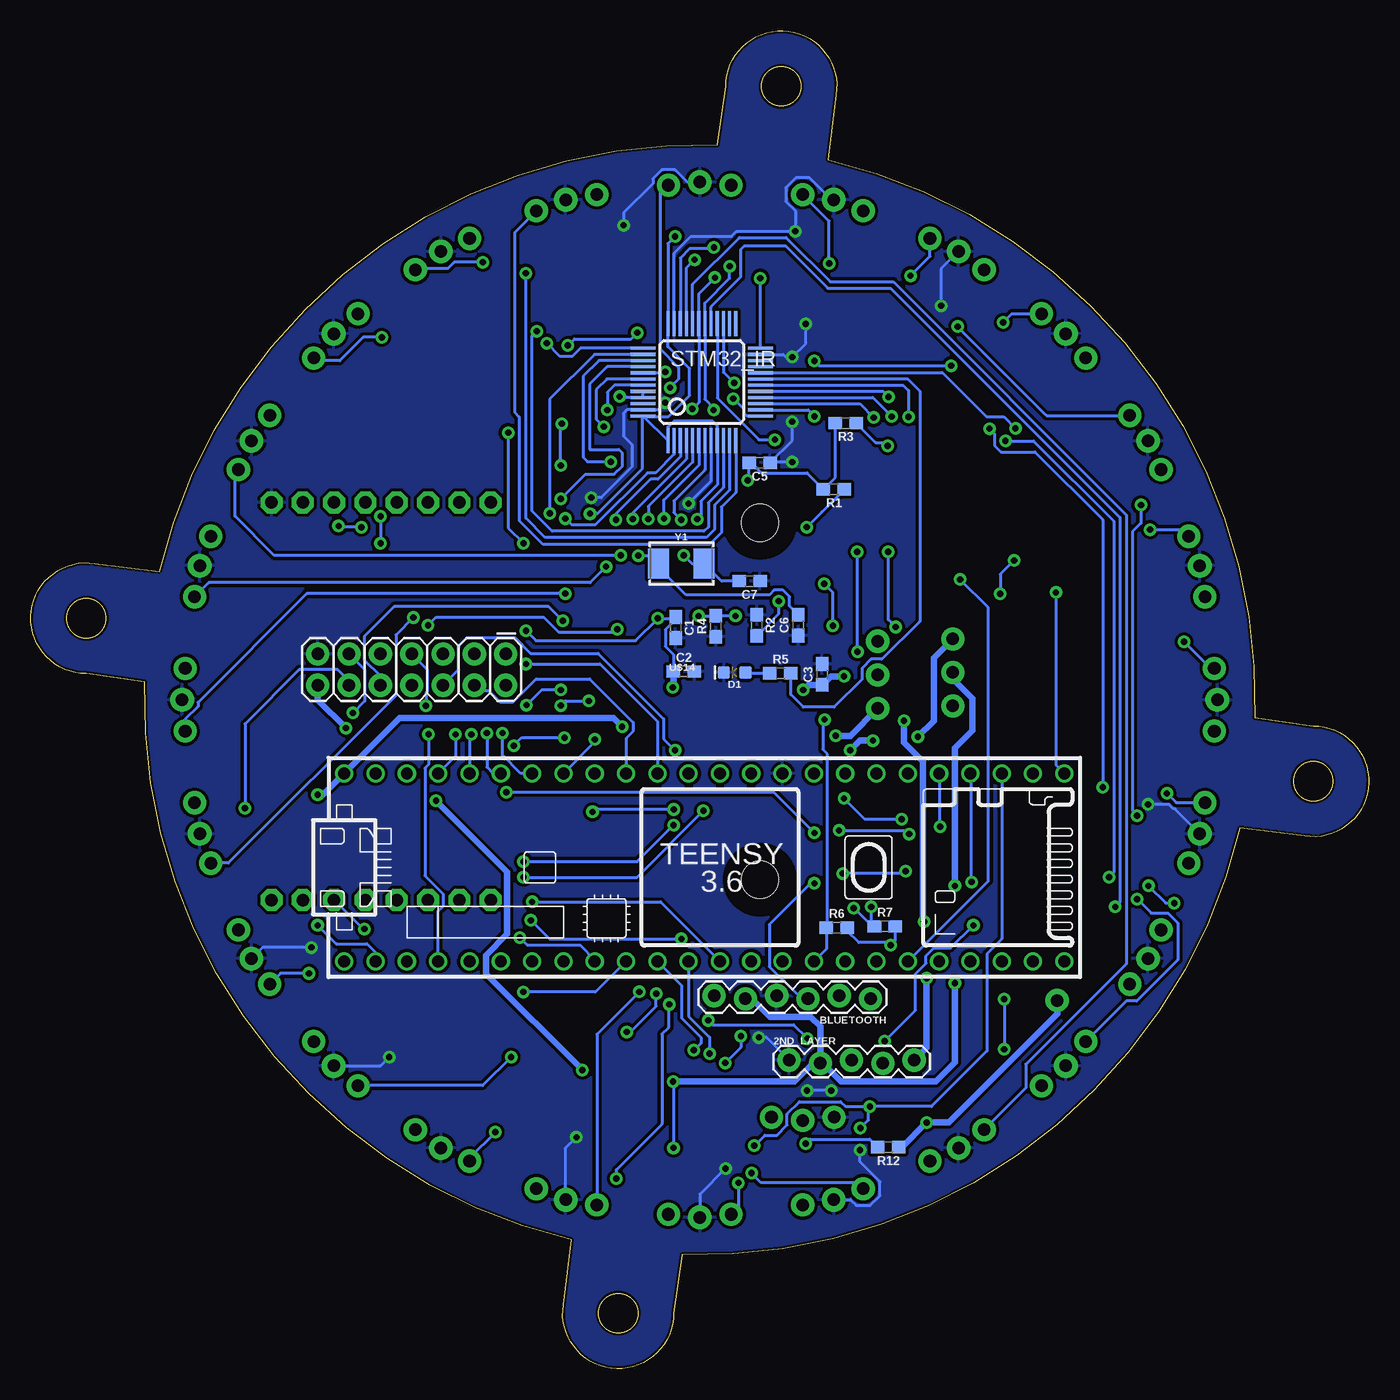
[diagram p6: board, bottom side, seen from below]

Size 108.54 x 108.54 mm. Coordinates in mm from the lower left corner, seen from the top.
Outline: 43.21,103.34 43.86,98.09 arc78 9.25,52.84 4.5,52.15 arc189 5.2,43.21 10.44,43.86 arc78 55.7,9.25 56.39,4.5 arc189 65.33,5.2 64.68,10.44 arc78 99.29,55.7 104.04,56.39 arc189 103.34,65.33 98.09,64.68 arc78 52.84,99.29 52.15,104.04 arc189 43.21,103.34
Outline: circle at 4.5,47.65 radius 1.6
Outline: circle at 60.89,4.5 radius 1.6
Outline: circle at 47.65,104.04 radius 1.6
Outline: circle at 104.04,60.89 radius 1.6
Copper layers (1*16): Top 0.035mm / dielectric 1.5mm / Bottom 0.035mm
Design rules "SparkFun-2-layer-STANDARD": minimum track width 10mil, minimum drill 20mil, track to track 10mil, track to pad 8mil, pad to pad 8mil, via to via 10mil, smd to smd 8mil, copper to edge 8mil, drill to drill 8mil, minimum pad ring 10mil, minimum via ring 10mil, stop-mask expansion 4mil, vias tented up to drill 25mil, thermal gap 10mil

### Footprints (pad centres in the part's own frame; a part is rotated, then mirrored left to right if it is on the bottom)
1X05_LOCK = drill 1.016 pad 1.88: 1 0,0.127; 2 2.54,-0.127; 3 5.08,0.127; 4 7.62,-0.127; 5 10.16,0.127
C0603 = smd 1.1 x 1: 1 -0.85,0; 2 0.85,0
TSSP58038 = drill 1.016 pad 1.93: GND 0,0 | drill 1.016 pad 1.88: OUT -0.254,-2.54; VS -0.254,2.54
SWITCH_SPDT_PTH_11.6X4.0MM_LOCK = drill 1.016 pad 1.88: 1 0,2.718; 2 0,0; 3 0,-2.718
SM04B-SRSS-TB = smd 0.6 x 1.55: 1 1.5,0; 2 0.5,0; 3 -0.5,0; 4 -1.5,0 | smd 1.2 x 1.8: M1 2.8,3.875; M2 -2.8,3.875
HC-05 = drill 1.016 pad 1.88: 1 0,0; 2 2.54,-0.254; 3 5.08,0; 4 7.62,-0.254; 5 10.16,0; 6 12.7,-0.254
MOMENTARY_SWITCH_4X3 = smd 1.3 x 1.6: P$1 -2.25,0; P$2 2.25,0
LED-0603 = smd 1 x 1: A -0.877,0; C 0.877,0
1X01 = drill 1.016 pad 1.88: 1 0,0
SOT23-3 = smd 0.8 x 0.9: 1 -0.95,-1; 2 0.95,-1; 3 0,1.1
R0603 = smd 1.1 x 1: 1 -0.85,0; 2 0.85,0
DIPSWITCH-04-SMD = smd 1.27 x 2.54: 1 -3.81,4.445; 2 -1.27,4.445; 3 1.27,4.445; 4 3.81,4.445; 5 3.81,-4.445; 6 1.27,-4.445; 7 -1.27,-4.445; 8 -3.81,-4.445
1X03_LOCK = drill 1.016 pad 1.88: 1 0,0.127; 2 2.54,-0.127; 3 5.08,0.127
LQFP48 = smd 0.254 x 2.032: 1 -2.75,-4.758; 2 -2.25,-4.758; 3 -1.75,-4.758; 4 -1.25,-4.758; 5 -0.75,-4.758; 6 -0.25,-4.758; 7 0.25,-4.758; 8 0.75,-4.758; 9 1.25,-4.758; 10 1.75,-4.758; 11 2.25,-4.758; 12 2.75,-4.758; 25 2.75,4.758; 26 2.25,4.758; 27 1.75,4.758; 28 1.25,4.758; 29 0.75,4.758; 30 0.25,4.758; 31 -0.25,4.758; 32 -0.75,4.758; 33 -1.25,4.758; 34 -1.75,4.758; 35 -2.25,4.758; 36 -2.75,4.758 | smd 2.032 x 0.254: 13 4.758,-2.75; 14 4.758,-2.25; 15 4.758,-1.75; 16 4.758,-1.25; 17 4.758,-0.75; 18 4.758,-0.25; 19 4.758,0.25; 20 4.758,0.75; 21 4.758,1.25; 22 4.758,1.75; 23 4.758,2.25; 24 4.758,2.75; 37 -4.758,2.75; 38 -4.758,2.25; 39 -4.758,1.75; 40 -4.758,1.25; 41 -4.758,0.75; 42 -4.758,0.25; 43 -4.758,-0.25; 44 -4.758,-0.75; 45 -4.758,-1.25; 46 -4.758,-1.75; 47 -4.758,-2.25; 48 -4.758,-2.75
TEENSY_3.5/3.6_NO_MIDDLE = drill 0.965: 0/RX -25.4,-7.62; 1/TX -22.86,-7.62; 2 -20.32,-7.62; 3/CANTX -17.78,-7.62; 3V3 7.62,-7.62; 3V3_LO -22.86,7.62; 4/CANRX -15.24,-7.62; 5 -12.7,-7.62; 6 -10.16,-7.62; 7 -7.62,-7.62; 8 -5.08,-7.62; 9/CS -2.54,-7.62; 10/CS 0,-7.62; 11/MOSI 2.54,-7.62; 12/MISO 5.08,-7.62; 13/SCK 5.08,7.62; 14/A0 2.54,7.62; 15/A1 0,7.62; 16/A2 -2.54,7.62; 17/A3 -5.08,7.62; 18/A4/SDA -7.62,7.62; 19/A5/SCL -10.16,7.62; 20/A6 -12.7,7.62; 21/A7 -15.24,7.62; 22/A8 -17.78,7.62; 23/A9 -20.32,7.62; 24 10.16,-7.62; 25 12.7,-7.62; 26 15.24,-7.62; 27 17.78,-7.62; 28 20.32,-7.62; 29 22.86,-7.62; 30 25.4,-7.62; 31/A12 27.94,-7.62; 32/A13 30.48,-7.62; 33/A14 30.48,7.62; 34/A15 27.94,7.62; 35/A16 25.4,7.62; 36/A17 22.86,7.62; 37/A18 20.32,7.62; 38/A19 17.78,7.62; 39/A20 15.24,7.62; A21/DAC0 12.7,7.62; A22/DAC1 10.16,7.62; AGND -25.4,7.62; GND -27.94,-7.62; GND2 7.62,7.62; VIN -27.94,7.62
OPENMV3 = drill 1.016 pad 1.778 octagon: 11 1.651,19.304; 12 1.651,16.764; 13 1.651,14.224; 14 1.651,11.684; 15 1.651,9.144; 16 1.651,6.604; 17 1.651,4.064; 18 1.651,1.524; 21 33.909,19.304; 22 33.909,16.764; 23 33.909,14.224; 24 33.909,11.684; 25 33.909,9.144; 26 33.909,6.604; 27 33.909,4.064; 28 33.909,1.524 | hole 3: 3.302,41.148; 32.258,41.148
2X7 = drill 1.016 pad 1.88: 1 0,0; 2 0,2.54; 3 2.54,0; 4 2.54,2.54; 5 5.08,0; 6 5.08,2.54; 7 7.62,0; 8 7.62,2.54; 9 10.16,0; 10 10.16,2.54; 11 12.7,0; 12 12.7,2.54; 13 15.24,0; 14 15.24,2.54
SM06B-SRSS-TB = smd 0.6 x 1.55: 1 2.5,0; 2 1.5,0; 3 0.5,0; 4 -0.5,0; 5 -1.5,0; 6 -2.5,0 | smd 1.2 x 1.8: M1 3.8,3.875; M2 -3.8,3.875
CRYSTAL-SMD-5X3.2-2PAD = smd 1.7 x 2.4: P$1 1.85,0; P$2 -1.85,0

### Placement (x,y rotation side)
2ND_LAYER  47.03,24.91 0 bottom
3C1  92.97,54.27 270 top
3C2  93.15,61.63 285 top
3C3  87.57,74.13 300 top
3C4  81.73,81.61 315 top
3C5  73.51,87.97 330 top
3C6  64.31,91.69 345 top
3C7  54.37,93.07 0 top
3C8  44.41,91.85 15 top
3C9  34.81,87.77 30 top
3C10  26.93,81.73 45 top
3C11  20.57,73.51 60 top
3C12  16.95,64.21 75 top
3C13  15.67,54.07 90 top
3C14  16.99,44.11 105 top
3C15  20.87,35.01 120 top
3C16  27.61,27.83 135 top
3C17  31.43,21.64 150 top
3C18  44.33,16.75 165 top
3C19  54.11,17.75 180 top
3C20  64.33,16.79 195 top
3C21  73.53,20.67 210 top
3C22  81.61,26.81 225 top
3C23  87.37,34.13 240 top
3C24  92.89,49.13 255 top
3U1  96.27,54.27 0 top
3U2  94.84,65.14 15 top
3U3  90.64,75.27 30 top
3U4  83.97,83.97 45 top
3U5  75.27,90.64 60 top
3U6  65.14,94.84 75 top
3U7  54.27,96.27 90 top
3U8  43.4,94.84 105 top
3U9  33.27,90.64 120 top
3U10  24.57,83.97 135 top
3U11  17.9,75.27 150 top
3U12  13.7,65.14 165 top
3U13  12.27,54.27 180 top
3U14  13.7,43.4 195 top
3U15  17.9,33.27 210 top
3U16  24.57,24.57 225 top
3U17  33.27,17.9 240 top
3U18  43.4,13.7 255 top
3U19  54.27,12.27 270 top
3U20  65.14,13.7 285 top
3U21  75.27,17.9 300 top
3U22  83.97,24.57 315 top
3U23  90.64,33.27 330 top
3U24  94.84,43.4 345 top
3V3_PWR  33.74,56.49 0 top
4TH_LAYER  60.25,24.8 180 top
5V_PWR  39.84,56.29 180 top
BLUETOOTH  40.41,30.01 180 bottom
BOOT  25.2,59.03 90 top
C1  56.22,60.13 270 bottom
C2  55.56,56.56 0 bottom
C3  44.34,56.32 90 bottom
C5  49.41,73.5 180 bottom
C6  46.28,60.33 90 bottom
C7  50.23,63.9 180 bottom
D1  51.44,56.48 180 bottom
J1  25.27,29.87 0 top
Q1  58.23,15.34 0 top
Q2  47.87,17.37 0 top
R1  43.39,71.34 180 bottom
R2  49.64,60.31 270 bottom
R3  42.43,76.72 180 bottom
R4  52.96,60.23 90 bottom
R5  47.73,56.41 0 bottom
R6  43.16,35.78 0 bottom
R7  39.25,35.88 0 bottom
R8  36.64,29.46 180 top
R9  32.98,28.43 270 top
R10  49.5,24.28 90 top
R11  38.07,19.97 0 top
R12  38.97,17.97 180 bottom
R13  38.97,17.97 0 top
RST  27.43,65 270 top
S1  38.96,68.64 180 top
SERVO_IO  43.37,20.27 0 top
STM32_IR  54.1,80.04 0 bottom
U$1  55.17,40.67 0 bottom
U$8  90.54,36.37 90 top
U$14  70.02,57.99 180 bottom
X1  69.9,77.66 0 top
Y1  55.76,65.32 0 bottom

### Tracks (layer width: path | path; a pad name or v marks a point on that pad's centre or on a via)
3.3V  (via drill 0.51)
  Top 0.254: 38.23,19.14 39.61,19.14 41.47,21 41.47,21.87 44.38,24.78 2ND_LAYER.2 44.49,21.07 44.64,20.92 44.64,18.04 45.3,17.38 46.66,17.38 46.92,17.12 Q2.1 | R11.1 37.4,19.97 38.23,19.14 | 38.23,19.14 38.23,18.08 R13.1 | Q1.1 57.28,17.03 v56.4,17.91
  Top 0.508: v33.57,39.17 v33.57,31.27 | v82.97,51.97 82.56,51.97 79.22,48.63 79.22,47.8 78.52,47.1 76.69,47.1 v75.67,46.07 | v63.79,24.23 62.32,24.23 4TH_LAYER.4 61.83,24.72 61.83,24.07 61.05,23.3 v56.43,23.3
  Bottom 0.254: v56.4,17.91 56.4,23.26 v56.43,23.3
  Bottom 0.508: 3V3_PWR.2 33.74,55.94 32.17,54.37 32.17,51.77 33.57,50.37 v33.57,39.17 | v33.57,31.27 33.57,24.87 35.12,23.32 42.81,23.32 44.27,24.78 2ND_LAYER.2 | 2ND_LAYER.2 45.1,24.78 46.59,23.3 v56.43,23.3 | v63.79,24.23 71.6,32.04 71.6,33.54 69.89,35.26 69.89,40.29 v75.67,46.07 | U$14.14 85.26,54.26 v82.97,51.97 | BLUETOOTH.5 50.03,30.01 48.57,28.56 45.29,28.56 44.49,27.76 2ND_LAYER.2
3V3_SWITCH  (via drill 0.51)
  Top 0.254: 3C11.1 19.98,72.94 3U11.VS 16.85,67.15 15.77,66.07 15.77,64.07 16.45,63.39 3C12.1 15.96,62.62 3U12.VS 13.29,58.35 14.47,57.17 14.47,53.47 14.72,53.22 3C13.1 14.18,51.73 3U13.VS 15.47,48.78 15.47,44.67 16.85,43.29 3C14.1 14.94,41.01 3U14.VS 18.97,36.65 18.97,34.97 20.17,33.77 20.79,33.77 3C15.1 21.29,33.1 3U15.VS 21.04,31.2 26.17,26.07 27.05,26.07 3C16.1 | 3C16.1 28.21,24.62 3U16.VS 26.72,23.13 31.01,23.13 31.77,22.37 31.77,21.61 3C17.1 35.6,17.78 3U17.VS 41.39,16.85 42.77,15.47 44.09,15.47 3C18.1 45.15,14.06 3U18.VS 46.8,14.17 54.38,14.17 54.96,14.75 3C19.1 54.96,15.31 56.81,13.46 3U19.VS 59.46,12.52 62.31,15.37 64.55,15.37 65.15,15.97 3C20.1 67.53,14.64 3U20.VS 71.89,18.97 73.87,18.97 74.26,19.36 3C21.1 75.97,19.39 3U21.VS 77.34,20.34 82.47,25.47 82.47,27.15 3C22.1 84.72,27.41 3U22.VS 85.58,30.38 88.17,32.97 88.17,34.49 3C23.1 90.96,34.86 3U23.VS 91.69,42.36 3U24.VS 95.25,47.81 3C24.1 93.11,51.31 94.27,52.47 94.27,53.82 3C1.1 94.33,55.12 3U1.VS 94.16,58.67 92.97,58.67 91.97,59.67 91.97,61.77 92.65,62.45 3C2.1 93.45,62.97 93.45,65.68 93.94,66.17 3U2.VS 93.94,68.07 89.06,72.95 89.06,73.71 88.3,74.47 87.54,74.47 3C3.1 89.15,76.87 3U3.VS 84.82,77.34 81.26,80.9 81.26,82.08 3C4.1 81.13,84.72 3U4.VS 74.82,85.58 72.75,87.66 72.75,88.37 3C5.1 72.95,88.56 3U5.VS 66.61,91.69 65.85,92.45 64.58,92.45 64.04,91.91 3C6.1 62.62,92.78 3U6.VS 61.54,94.17 54.27,94.17 53.52,93.42 3C7.1 | 3C7.1 51.73,94.86 3U7.VS 48.88,93.17 44.57,93.17 43.59,92.19 3C8.1 41.28,93.94 3U8.VS 36.65,89.57 34.77,89.57 33.77,88.57 33.77,87.65 3C9.1 33,87.34 3U9.VS 31.2,87.7 26.07,82.57 26.07,81.39 3C10.1 23.82,81.13 3U10.VS
  Top 0.254: v56.27,91.87 54.72,91.87 3C7.1 | v49.37,88.47 49.37,88.92 3C7.1 | v54.47,68.93 53.51,68.93 v50.37,72.07 | v63.17,69.37 63.55,68.99 63.55,62.05 62.37,60.87 v57.67,60.87 | 3C16.1 32.63,27.23 R9.2 34.86,29.46 R8.2 38.77,32.44 v38.77,34.37 | X1.4 69.4,76.35 v69.81,75.94 | v68.57,66.97 68.37,66.77 v68.37,59.87
  Top 0.508: v42.07,50.17 42.07,55.67 v42.57,56.17 | v45.87,55.07 56.27,55.07 v56.47,55.27 | v36.57,51.27 39.91,51.27 v40.22,50.96
  Bottom 0.254: v56.27,91.87 56.85,91.29 STM32_IR.36 56.85,82.91 55.09,81.15 55.09,78.95 56.8,77.23 58.8,77.23 STM32_IR.48 | v54.47,68.93 54.19,69.21 54.19,70.38 52.85,71.72 STM32_IR.9 52.85,76.48 53.24,76.87 56.37,76.87 56.85,76.39 STM32_IR.1 STM32_IR.48 | v50.37,72.07 50.26,72.18 C5.2 50.08,73.5 49.25,72.67 45.57,72.67 R1.2 43.28,72.3 R3.2 | STM32_IR.48 58.97,77.18 58.97,72.97 62.57,69.37 v63.17,69.37 | R7.2 38.4,34.74 v38.77,34.37 38.97,34.57 41.37,34.57 42.31,35.51 R6.2 | v69.81,75.94 69.81,68.21 v68.57,66.97 | v68.37,59.87 67.57,59.07 59.47,59.07 v57.67,60.87 56.33,60.87 C1.1 56.22,60.8 57.05,59.97 57.05,58.59 56.41,57.95 C2.1 | STM32_IR.24 49.34,88.44 v49.37,88.47
  Bottom 0.508: 3V3_PWR.1 35.28,57.67 35.28,52.56 v36.57,51.27 | v42.57,56.17 43.64,56.17 C3.1 45.47,55.47 v45.87,55.07 | v56.47,55.27 56.41,55.33 C2.1 | v40.22,50.96 41.28,50.96 v42.07,50.17
5V  (via drill 0.51)
  Top 0.508: 5V_PWR.2 37.7,54.15 v37.7,52.56 | v36.07,36.27 36.07,31.87 v35.87,31.67 | R10.1 49.2,23.43 SERVO_IO.2 45.91,21.12 48.43,23.64 48.43,26.76 47.36,27.83 37.66,27.83 36.87,27.04 2ND_LAYER.5 35.87,24.04 v35.87,19.97
  Bottom 0.508: v37.7,52.56 v37.69,52.55 37.69,50.79 36.17,49.27 36.17,36.37 v36.07,36.27 | v35.87,31.67 35.87,26.04 2ND_LAYER.5 | R12.1 37.87,17.97 v35.87,19.97 34.08,19.97 25.27,28.78 J1.1
5V_SWITCH  (via drill 0.51)
  Top 0.508: v43.25,51.35 59.85,51.35 v60.57,52.07 | U$8.27 86.48,68.18 86.79,67.87 86.79,48.09 v85.27,46.57
  Bottom 0.508: 5V_PWR.1 42.06,51.35 v43.25,51.35 | v60.57,52.07 61.27,52.77 78.63,52.77 U$1.VIN 84.83,46.57 v85.27,46.57
BATT_LVL  (via drill 0.51)
  Top 0.254: v82.4,53.2 78.56,49.36 75.05,49.36 74.42,48.73 74.42,48.25 72.94,46.77 v69.97,46.77 | v44.97,43.47 43.17,43.47 v42.97,43.67 | v37.28,43.38 35.37,43.38 v34.77,43.98
  Bottom 0.254: v69.97,46.77 48.27,46.77 v44.97,43.47 | v42.97,43.67 37.57,43.67 v37.28,43.38 | v34.77,43.98 34.77,48.21 U$1.37/A18 | U$14.11 81.45,56.72 81.45,54.15 v82.4,53.2
BL_DIR  (via drill 0.51)
  Top 0.254: U$1.18/A4/SDA 62.79,45.35 v62.97,45.17 | v56.27,50.17 56.37,50.07 v56.37,45.37
  Bottom 0.254: v56.27,50.17 57.2,51.1 57.2,52.72 62.52,58.04 67.98,58.04 69.25,59.31 73.15,59.31 73.83,58.63 73.83,58.52 73.83,56.72 U$14.6 | v56.37,45.37 62.77,45.37 v62.97,45.17
BL_PWM  (via drill 0.51)
  Top 0.254: v72.81,51.46 72.81,52.12 73.13,52.44 73.13,53.47 73.84,54.18 75.63,54.18 76.37,54.92 76.37,55.98 75.1,57.25 U$14.5
  Bottom 0.254: v72.81,51.46 72.95,51.32 U$1.22/A8
BOOT0  (via drill 0.51)
  Top 0.254: BOOT.P$2 51.16,61.28 v51.37,61.07 | v60.77,78.87 60.77,77.27 60.27,76.77 60.27,71.17 62.27,69.17 62.27,66.47 62.97,65.77 62.97,63.07 62.17,62.27 55.57,62.27 v54.37,61.07
  Bottom 0.254: v51.37,61.07 R4.2 | R4.2 | STM32_IR.44 STM32_IR.45 60.69,78.79 v60.77,78.87 | v54.37,61.07 R4.2
BR_DIR  (via drill 0.51)
  Top 0.254: v62.79,51.05 65.53,53.8 v65.55,53.8 | v63.27,54.17 63.27,57.68 v60.97,59.98 | U$14.8 77.64,56.19 76.37,57.46 76.37,60.25 v76.31,60.31
  Bottom 0.254: v60.97,59.98 61.17,59.78 65.74,59.78 66.93,60.97 75.17,60.97 75.65,60.97 v76.31,60.31 | U$1.19/A5/SCL 62.79,50.83 v62.79,51.05 | v65.55,53.8 65.18,54.17 v63.27,54.17
BR_PWM  (via drill 0.51)
  Top 0.254: v74.08,51.46 74.16,51.46 v76.49,53.79
  Bottom 0.254: v74.08,51.46 74.08,49.7 U$1.23/A9 | v76.49,53.79 76.49,54.8 76.37,54.92 76.37,56.72 U$14.7
DIP1  (via drill 0.51)
  Top 0.254: v43.47,60.27 43.86,59.88 43.86,52.95 v44.15,52.66 | v44.17,63.67 43.29,63.67 S1.1
  Bottom 0.254: U$1.24 44.01,34.05 R6.1 43.91,35.88 43.91,49.87 44.28,50.24 44.28,52.53 v44.15,52.66 | v43.47,60.27 43.47,62.97 v44.17,63.67
DIP2  (via drill 0.51)
  Top 0.254: v41.47,58.17 41.17,57.87 41.17,38.27 v40.37,37.47 | v41.77,37.37 42.47,36.67 U$1.25 | v41.5,66.28 41.5,65.46 S1.2
  Bottom 0.254: v40.37,37.47 40.37,36.15 R7.1 40.28,35.88 v41.77,37.37 | v41.47,58.17 41.47,66.25 v41.5,66.28
DIP3  (via drill 0.51)
  Top 0.254: R8.1 39.93,31.9 U$1.26 39.97,33.09 39.97,35.47 38.77,36.67 38.77,48.42 37.83,49.36 36.45,49.36 35.68,50.13 35.68,57.48 v38.37,60.17 | S1.3 37.69,64.99 v38.98,66.28
  Bottom 0.254: v38.37,60.17 38.97,60.77 38.97,66.27 v38.98,66.28
DIP4  (via drill 0.51)
  Top 0.254: R9.1 34.48,30.78 36.24,30.78 36.76,31.3 36.76,32.42 U$1.27 | v33.15,64.03 33.31,64.19 S1.4
  Bottom 0.254: U$1.27 30.87,39.57 30.87,61.75 v33.15,64.03
ESC_HV  (via drill 0.51)
  Top 0.254: R10.2 49.5,25.55 v50.93,26.98 | v52.2,24.81 52.2,20.03 52.9,19.33 56.88,19.33 58.23,17.97 Q1.3
  Bottom 0.254: v52.2,24.81 50.93,26.08 v50.93,26.98
ESC_LV  (via drill 0.51)
  Top 0.254: v32.07,35.97 32.07,39.33 v32.22,39.48 | R11.2 39.41,20.46 2ND_LAYER.4 39.27,24.92 v39.27,26.57 45.32,26.57 v45.54,26.79 | v61.03,15.43 60.27,15.43 Q1.2 | v53.58,28.26 55.45,28.26 v56.75,29.55
  Bottom 0.254: v39.27,26.57 36.76,29.08 36.76,32.04 35.92,32.88 35.92,33.49 35.29,34.12 33.92,34.12 v32.07,35.97 | v32.22,39.48 32.22,48.2 U$1.36/A17 | v61.03,15.43 61.03,16.14 57.34,19.83 57.34,27.14 56.78,27.7 56.78,29.52 v56.75,29.55 | v45.54,26.79 46.65,27.9 53.22,27.9 v53.58,28.26
FL_DIR  (via drill 0.51)
  Top 0.254: U$14.2 68.37,57.1 v68.37,57.17
  Bottom 0.254: v68.37,57.17 62.37,57.17 57.71,52.51 U$1.16/A2
FL_PWM  (via drill 0.51)
  Top 0.254: v70.27,51.57 70.08,51.76 70.08,53.71 71.29,54.92 71.29,55.98 70.02,57.25 U$14.1
  Bottom 0.254: U$1.20/A6 68.79,48.29 70.27,49.77 v70.27,51.57
FR_DIR
  Bottom 0.254: U$1.17/A3 60.25,51.13 59.68,51.7 59.68,52.44 63.2,55.96 67.54,55.96 69.4,54.1 70.48,54.1 71.35,54.97 72.08,54.97 U$14.4
FR_PWM  (via drill 0.51)
  Top 0.254: v71.54,51.57 72.62,52.65 72.62,53.71 73.83,54.92 73.83,56.72 U$14.3
  Bottom 0.254: v71.54,51.57 71.54,48.81 71.02,48.29 U$1.21/A7
GND  (via drill 0.51)
  Top 0.254: v17.9,45.78 17.04,44.93 3C14.2 | 3C23.2 86.55,33.39 v85.77,34.17 | v79.47,25.27 80.41,26.21 3C22.2 | v34.69,86.24 35.74,86.24 36.07,86.57 36.07,87.67 3C9.2 | v64.27,18.77 63.77,18.77 63.51,18.51 3C20.2 | v41.27,17.74 41.8,18.27 42.37,18.27 43.51,17.13 3C18.2 | v46.52,92.28 45.44,92.28 3C8.2 | v60.45,92.77 55.52,92.77 3C7.2 | v46.77,82.07 v46.76,82.06 v46.76,76.83 | v55.18,70.19 55.18,76.48 v57.07,78.37 | SERVO_IO.1 43.37,22.32 v43.6,22.56 | v45.57,22.57 47.03,24.03 2ND_LAYER.1 | 3C19.2 53.26,17.32 v52.18,16.24 | v49.47,26.87 49.47,28.82 BLUETOOTH.4 | S1.8 46.3,73.08 v46.77,73.56
  Bottom 0.254: v63.07,70.67 62.27,70.67 59.77,73.17 59.77,74.97 60.47,75.67 60.47,77.47 60.15,77.79 STM32_IR.47 57.65,77.79 v57.07,78.37 | 3U14.GND 15.71,45.41 15.83,45.41 16.2,45.78 v17.9,45.78 | v85.77,34.17 89.74,34.17 3U23.GND | 3U22.GND 80.17,24.57 v79.47,25.27 | 3U9.GND 34.69,89.23 v34.69,86.24 | 3U20.GND 65.14,17.9 v64.27,18.77 | v41.27,17.74 41.27,16.79 39.65,15.17 39.65,14.04 40.45,13.24 41.58,13.24 42.04,13.7 3U18.GND | 3U8.GND 43.58,94.84 45.35,96.61 46.48,96.61 47.28,95.81 47.28,94.69 46.52,93.93 v46.52,92.28 v46.53,92.28 51.28,92.28 51.69,91.87 54.97,91.87 56.35,90.49 STM32_IR.35 | 3U7.GND 55.27,96.27 56.28,97.29 57.34,97.29 58.08,96.54 58.08,96.14 60.45,93.77 v60.45,92.77 | v46.76,76.83 46.76,75.3 C5.1 48.5,73.56 v46.77,73.56 | v45.67,84.77 45.67,83.17 v46.77,82.07 47.27,82.07 47.49,82.29 STM32_IR.23 | STM32_IR.8 53.35,72.03 v55.18,70.2 v55.18,70.19 | v43.6,22.56 43.61,22.57 v45.57,22.57 | v52.18,16.24 54.27,14.15 3U19.GND | 2ND_LAYER.1 48.86,26.87 v49.47,26.87
  pour Bottom: -41.13,144.87 149.67,144.87 149.67,-17.53 -41.13,-17.53
  pour Top: -17.13,122.77 127.47,122.77 127.47,-35.03 -17.13,-35.03
IR1  (via drill 0.51)
  Top 0.254: v65.17,68.97 v65.17,62.88
  Bottom 0.254: STM32_IR.2 56.35,74.19 57.86,72.68 58.52,72.68 62.73,68.47 64.67,68.47 v65.17,68.97 | v65.17,62.88 86.16,62.88 94.97,54.06 94.97,53.73 96.02,52.69 3U1.OUT
IR2  (via drill 0.51)
  Top 0.254: v61.07,68.87 61.67,68.27 61.67,65.27 v61.87,65.07
  Bottom 0.254: STM32_IR.3 55.85,73.99 57.67,72.17 58.26,72.17 61.07,69.36 v61.07,68.87 | v61.87,65.07 63.17,63.77 94.1,63.77 3U2.OUT
IR3  (via drill 0.51)
  Top 0.254: v59.71,68.93 59.71,66.94 v60.67,65.98
  Bottom 0.254: STM32_IR.4 55.35,73.79 59.71,69.43 v59.71,68.93 | v60.67,65.98 88.78,65.98 91.97,69.17 91.97,72.67 3U3.OUT
IR4  (via drill 0.51)
  Top 0.254: v80.07,83.67 75.47,83.67 74.97,84.17 v67.49,84.17
  Bottom 0.254: STM32_IR.10 52.35,71.49 53.58,70.26 53.58,68.3 53.94,67.94 66.24,67.94 67.87,69.57 67.87,83.79 v67.49,84.17 | v80.07,83.67 81.57,83.67 83.47,81.77 85.36,81.77 3U4.OUT
IR5  (via drill 0.51)
  Top 0.254: v68.38,88.87 70.97,88.87 v71.87,89.77
  Bottom 0.254: STM32_IR.11 51.85,71.29 53.07,70.07 53.07,68.09 53.73,67.43 66.81,67.43 68.38,69 v68.38,88.87 | v71.87,89.77 74.19,89.77 74.71,89.25 77.24,89.25 3U5.OUT
IR6
  Bottom 0.254: STM32_IR.12 51.35,71.09 52.52,69.92 52.52,67.82 53.47,66.87 66.97,66.87 68.91,68.81 68.91,77.21 69.27,77.57 69.27,92.19 3U6.OUT
IR7  (via drill 0.51)
  Top 0.254: v51.54,78.7 51.56,78.7 52.44,79.58 v56.68,79.58
  Bottom 0.254: v51.54,78.7 50.69,77.84 50.69,77.53 50.45,77.29 STM32_IR.13 | v56.68,79.58 55.98,80.28 55.98,81.22 57.46,82.7 57.46,95.37 3U7.OUT
IR8  (via drill 0.51)
  Top 0.254: v44.97,77.27 43.67,78.57 43.67,89.57 v43.77,89.67
  Bottom 0.254: STM32_IR.14 49.32,77.77 45.47,77.77 v44.97,77.27 | v43.77,89.67 43.77,93.1 3U8.OUT
IR9  (via drill 0.51)
  Top 0.254: v40.16,77.17 40.16,85.68 v37.17,88.67
  Bottom 0.254: STM32_IR.15 41.28,78.29 v40.16,77.17 | v37.17,88.67 35.6,90.24 3U9.OUT
IR10  (via drill 0.51)
  Top 0.254: v38.7,77.25 38.7,77.84 31.65,84.89 v29.65,84.89
  Bottom 0.254: STM32_IR.16 40.24,78.79 v38.7,77.25 | v29.65,84.89 28.95,85.58 3U10.OUT
IR11  (via drill 0.51)
  Top 0.254: v33.35,84.55 38.96,78.93 v38.96,78.85
  Bottom 0.254: v33.35,84.55 26.14,77.34 3U11.OUT | STM32_IR.17 39.4,79.29 v38.96,78.85
IR12  (via drill 0.51)
  Top 0.254: v37.33,77.22 26.89,77.22 v17.74,68.07
  Bottom 0.254: STM32_IR.18 37.77,79.79 37.33,79.35 v37.33,77.22 | v17.74,68.07 15.15,68.07 3U12.OUT
IR13  (via drill 0.51)
  Top 0.254: v28.66,76.28 19.16,66.78 19.16,62.16 15.97,58.97 v14.97,58.97
  Bottom 0.254: STM32_IR.20 49.31,80.82 34.6,80.82 31.01,77.23 29.61,77.23 v28.66,76.28 | v14.97,58.97 12.81,56.81 3U13.OUT
IR14  (via drill 0.51)
  Top 0.254: v51.47,79.97 51.47,79.94 47.45,75.92 45.82,75.92 45.48,76.26 v30.77,76.26 | v21.57,47.17 21.07,46.67 v16.37,46.67
  Bottom 0.254: STM32_IR.27 52.35,80.85 v51.47,79.97 | v30.77,76.26 30.36,75.85 30.36,74.9 29.84,74.38 27.08,74.38 21.57,68.87 v21.57,47.17 | v16.37,46.67 15.62,45.92 3U14.OUT
IR15  (via drill 0.51)
  Top 0.254: v29.47,75.27 29.57,75.37 31.27,75.37 31.65,75.75 45.27,75.75 45.65,75.37 v48.17,75.37 | v21.07,39.87 18.57,39.87 v17.87,39.17 | v15.77,37.77 16.85,36.69 3U15.OUT
  Bottom 0.254: STM32_IR.28 52.85,78.75 49.47,75.37 v48.17,75.37 | v29.47,75.27 27.19,75.27 20.69,68.77 20.69,40.25 v21.07,39.87 | v17.87,39.17 16.47,37.77 v15.77,37.77
IR16  (via drill 0.51)
  Top 0.254: v20.56,37.47 19.4,37.47 v18.78,38.09
  Bottom 0.254: STM32_IR.29 53.35,86.16 50.95,88.56 50.95,90.79 50.67,91.07 47.29,91.07 43.88,87.66 38.78,87.66 20.18,69.06 20.18,37.85 v20.56,37.47 | 3U16.OUT 19.67,29.83 18.82,29.83 15.48,33.17 15.48,36.16 16.28,36.96 17.65,36.96 v18.78,38.09
IR17
  Bottom 0.254: STM32_IR.32 54.85,87.97 51.05,91.77 47.27,91.77 43.67,88.17 38.57,88.17 19.67,69.27 19.67,32.84 27.82,24.69 27.82,22.77 3U17.OUT
IR18  (via drill 0.51)
  Top 0.254: v54.69,89.97 59.17,89.97 63.47,85.67 63.47,83.77 63.46,83.76 63.46,76.46 65.76,74.16 79.18,74.16 80.17,73.17 v80.17,69.16 | v69.35,50.53 78.83,50.53 81.45,53.15 81.45,58.63 80.17,59.91 v80.17,66.97 | v65.24,51.2 | v65.24,51.2 64.19,51.2 61.72,48.73 61.72,31.74 57.31,27.33 52.58,27.33 50.77,25.52 50.77,16.57 v50.07,15.87
  Bottom 0.254: STM32_IR.33 55.35,89.31 v54.69,89.97 | 3U18.OUT 41.5,15.09 49.29,15.09 v50.07,15.87 | v69.35,50.53 69.35,50.56 68.71,51.2 v65.24,51.2 | v80.17,69.16 v80.17,66.97
IR19  (via drill 0.51)
  Top 0.254: v66.44,69.4 66.44,51.14 63.86,48.56 63.86,32.48 58.2,26.82 52.81,26.82 51.28,25.29 51.28,15.22 v51.13,15.07
  Bottom 0.254: v66.44,69.4 66.44,78.66 62.81,82.29 STM32_IR.38 | v51.13,15.07 51.13,13.12 3U19.OUT
IR20  (via drill 0.51)
  Top 0.254: v61.48,73.57 61.48,73.51 64.26,70.74 64.26,53.81 59.17,48.72 v59.17,30.57
  Bottom 0.254: STM32_IR.39 62.46,81.79 63.72,80.53 63.72,73.94 63.37,73.59 61.5,73.59 v61.48,73.57 | v59.17,30.57 62.62,27.12 3U20.OUT
IR21  (via drill 0.51)
  Top 0.254: v65.55,70.57 65.83,70.29 66.81,70.29 67.43,69.66 67.43,51.12 66.44,50.13 66.44,47.89 64.87,46.32 64.87,35.02 66.4,33.49 66.4,30.94 70.85,26.49 v70.85,19.19
  Bottom 0.254: STM32_IR.40 61.78,81.29 63.2,79.87 63.2,74.57 60.83,74.57 60.59,74.34 60.59,73.18 61.21,72.57 63.55,72.57 v65.55,70.57 | v70.85,19.19 72.94,17.1 3U21.OUT
IR22  (via drill 0.51)
  Top 0.254: v44.97,81.77 46.37,83.17 54.77,83.17 v57.07,80.87 | v33.87,81.37 30.37,77.87 26.57,77.87 20.99,72.29 20.99,72.24 18.82,70.07 v18.47,70.07 | v18.78,44.87 37.58,44.87 v37.88,44.57 | v57.8,30.43 57.8,31.45 56.64,32.61 56.64,41.2 53.77,44.07 45.63,44.07 45.34,44.36 44.48,44.36 v42.57,46.27 | v69.57,25.27 67.52,27.32 v60.19,27.32
  Bottom 0.254: 3U22.OUT 81.97,22.97 71.87,22.97 v69.57,25.27 | STM32_IR.41 57.15,80.79 v57.07,80.87 | v44.97,81.77 44.57,81.37 v33.87,81.37 | v18.47,70.07 18.47,68.59 19.16,67.9 19.16,45.25 v18.78,44.87 | v37.88,44.57 40.87,44.57 v42.57,46.27 | v57.8,30.43 57.8,29.4 59.88,27.32 v60.19,27.32
IR23  (via drill 0.51)
  Top 0.254: v81.73,68.27 70.52,68.27 66.4,72.38 64.88,72.38 62.45,74.82 62.45,76.04 v62.06,76.42 | v83.57,68.37 83.99,67.95 83.99,48.92 84.18,48.73 84.18,39.99 82.72,38.53 82.72,35.32 v85.97,32.07
  Bottom 0.254: v62.06,76.42 62.67,77.03 62.67,79.43 61.81,80.29 STM32_IR.42 | v81.73,68.27 83.47,68.27 v83.57,68.37 | v85.97,32.07 88.28,32.07 3U23.OUT
IR24  (via drill 0.51)
  Top 0.254: v61.77,77.77 61.77,77.47 61.17,76.87 61.17,75.27 64.77,71.67 66.21,71.67 76.94,60.94 v77.51,60.94
  Bottom 0.254: STM32_IR.43 61.19,79.79 61.77,79.21 v61.77,77.77 | v77.51,60.94 78.91,59.54 78.91,54.63 92.53,41.01 3U24.OUT
LIGHT_INT  (via drill 0.51)
  Top 0.254: v76.27,51.47 76.27,51.53 78.91,54.17 78.91,55.98 80.18,57.25 U$14.9
  Bottom 0.254: v76.27,51.47 76.27,49.02 76.56,48.73 76.56,39.99 75.1,38.53 75.1,37.52 75.49,37.12 U$1.2
MISO  (via drill 0.51)
  Top 0.254: U$8.12 72.12,36.37 v67.97,36.37 | v55.75,34.87 51.91,34.87 U$1.12/MISO
  Bottom 0.254: v67.97,36.37 66.47,34.87 v55.75,34.87
MOSI  (via drill 0.51)
  Top 0.254: U$8.11 68.02,38.02 v67.87,37.87
  Bottom 0.254: v67.87,37.87 57.45,37.87 U$1.11/MOSI
N$70  (via drill 0.51)
  Top 0.254: RST.P$1 28.77,65.91 v28.77,65.57 | v29.89,62.86 30.48,62.27 v47.87,62.27
  Bottom 0.254: v28.77,65.57 29.89,64.45 v29.89,62.86 | v47.87,62.27 47.87,61.23 R2.2
N$72  (via drill 0.51)
  Top 0.254: BOOT.P$1 24.86,56.78 22.97,58.67 22.97,67.85 25.46,70.34 29.51,74.38 29.84,74.38 30.32,74.86 v39.02,74.86
  Bottom 0.254: R3.1 40,75.14 39.31,75.14 v39.02,74.86
N$73
  Bottom 0.254: STM32_IR.19 49.32,80.31 37.41,80.31 36.42,79.32 36.42,60.63 39.49,57.56 40.37,57.56 41.11,56.82 41.11,55.93 43.37,53.67 45.87,53.67 46.88,54.68 R5.2
N$74
  Bottom 0.254: R5.1 50.49,56.41 D1.A
OSC_IN  (via drill 0.51)
  Top 0.254: v58.44,68.93 58.44,66.77 v59.25,65.96
  Bottom 0.254: STM32_IR.5 54.85,73.55 58.45,69.95 58.44,69.93 v58.44,68.93 | v59.25,65.96 58.25,65.96 Y1.P$2 57.61,65.01 55.37,62.77 48.63,62.77 48.24,63.16 47.5,63.16 46.98,62.64 46.98,61.88 C6.2
OSC_OUT  (via drill 0.51)
  Top 0.254: v57.17,68.97 57.17,67.58 v55.57,65.98
  Bottom 0.254: STM32_IR.6 54.35,73.29 57.17,70.47 v57.17,68.97 | v55.57,65.98 54.91,65.32 Y1.P$1 52.49,63.9 C7.2
RESET  (via drill 0.51)
  Top 0.254: RST.P$2 28.51,62.75 30.45,64.69 30.45,67.87 31.84,69.26 44.6,69.26 v45.59,68.27 45.59,68.01 48.1,65.5 52.3,65.5 55.67,68.87 v55.77,68.87
  Bottom 0.254: R1.1 44.37,69.51 44.37,69.49 v45.59,68.27 | STM32_IR.7 53.85,72.91 56.37,70.39 56.37,69.47 v55.77,68.87
RX1_ST2  (via drill 0.51)
  Top 0.254: X1.6 66.41,76.67 v65.47,76.67 | v54.87,77.87 48.75,71.75 47.87,71.75 45.89,69.77 31.46,69.77 29.49,67.8 29.49,66.1 29.66,65.94 29.66,65.2 28.19,63.73 26.49,63.73 25.73,62.97 v25.37,62.97 | v53.04,88.52 54.07,88.52 58.35,84.25 58.35,83.68 58.87,83.16 61.48,83.16 62.95,81.69 62.95,76.17 65.55,73.57 v65.55,73.27
  Bottom 0.254: v53.04,88.52 54.35,87.21 STM32_IR.31 54.35,78.39 v54.87,77.87 | v65.47,76.67 65.57,76.57 65.57,73.29 v65.55,73.27 | v25.37,62.97 25.37,48.97 U$1.33/A14
RX2_ST3  (via drill 0.51)
  Top 0.254: v53.47,25.57 54.24,24.8 4TH_LAYER.1
  Bottom 0.254: U$1.10/CS 55.17,28.59 53.47,26.89 v53.47,25.57
RX3_ST1  (via drill 0.51)
  Top 0.254: v65.37,60.67 65.37,55.25 v65.55,55.07 | U$1.1/TX 78.03,32.73 76.57,31.27 69.77,31.27 68.94,32.1 68.94,33.49 66.98,35.45 66.98,38.24 67.5,38.76 67.52,38.76 67.53,38.77 67.53,46.44 68.94,47.85 68.94,48.73 68.33,49.34 v68.33,53.84
  Bottom 0.254: v65.37,60.67 66.57,61.87 79.03,61.87 81.45,59.45 81.45,57.46 80.18,56.19 U$14.10 | v65.55,55.07 67.1,55.07 v68.33,53.84
RX_BT  (via drill 0.51)
  Top 0.254: U$1.32/A13 27.77,29.97 v29.57,29.97 | BLUETOOTH.2 42.95,28.87 42.56,28.48 34.68,28.48 34.1,27.9 34.1,26.83 33.14,25.87 29.61,25.87 v29.57,25.91
  Bottom 0.254: v29.57,29.97 v29.57,25.91
SCK  (via drill 0.51)
  Top 0.254: U$8.13 74.97,39.37 69.07,39.37 v68.57,39.87 | v53.97,45.27 52.63,46.61 U$1.14/A0
  Bottom 0.254: v68.57,39.87 59.37,39.87 v53.97,45.27
SCL0_TEE  (via drill 0.51)
  Top 0.254: U$8.15 78.34,34.97 v68.87,34.97
  Bottom 0.254: v68.87,34.97 68.26,34.36 63.97,34.36 62.79,33.18 U$1.7
SDA0_TEE  (via drill 0.51)
  Top 0.254: v68.58,30.56 77.76,30.56 79.5,32.3 79.5,33.49 81.47,35.46 v81.47,35.67
  Bottom 0.254: U$1.8 62.74,30.56 v68.58,30.56 | v81.47,35.67 81.58,35.67 U$8.16
SERVO_HV  (via drill 0.51)
  Top 0.254: SERVO_IO.3 48.45,19.05 Q2.3 47.67,18.27 v45.67,18.27
  Bottom 0.254: v45.67,18.27 45.31,18.62 40.47,18.62 R12.2
SERVO_LV  (via drill 0.51)
  Top 0.254: 2ND_LAYER.3 40.47,23.56 v40.47,21.27 | v49.84,18.1 49.84,17.39 Q2.2 | R13.2 39.82,18.1 v41.24,19.51
  Bottom 0.254: U$1.35/A16 29.77,34.87 30.97,33.67 30.97,25.77 35.47,21.27 v40.47,21.27 40.57,21.27 | 40.57,21.27 42.45,21.27 42.84,21.67 46.18,21.67 47.18,20.67 47.18,19.77 48,18.95 48.99,18.95 v49.84,18.1 | v41.24,19.51 40.57,20.18 40.57,21.27
SS  (via drill 0.51)
  Top 0.254: U$8.14 78.86,40.04 78.6,40.3 69.41,40.3 v68.57,41.14 | v56.4,44.1 56.02,44.48 56,44.48 55.17,45.31 U$1.15/A1
  Bottom 0.254: v68.57,41.14 59.36,41.14 v56.4,44.1
SWCLK  (via drill 0.51)
  Top 0.254: X1.2 71.4,78.47 v66.67,83.2
  Bottom 0.254: STM32_IR.37 63.94,82.79 64.61,82.12 65.59,82.12 v66.67,83.2
SWDIO  (via drill 0.51)
  Top 0.254: v53.12,90.97 53.17,90.92 59.74,90.92 64.07,86.59 64.07,76.67 66.07,74.67 69.97,74.67 70.7,75.4 70.7,77.36 X1.3
  Bottom 0.254: STM32_IR.34 55.85,90.11 55.06,90.9 53.19,90.9 v53.12,90.97
TX1_ST2  (via drill 0.51)
  Top 0.254: v51.84,89.44 53.94,89.44 v59.34,84.05 | v64.98,83.01 64.98,80.68 65.35,80.3 66.84,80.3 66.9,80.37 67.47,80.37 68.4,79.44 X1.5 | U$1.34/A15 27.23,57.33 24.07,60.49 24.07,65.81 28.65,70.38 45.76,70.38 v53.15,77.77
  Bottom 0.254: v51.84,89.44 51.84,88.46 53.85,86.45 STM32_IR.30 53.85,78.65 53.15,77.95 v53.15,77.77 | v59.34,84.05 59.84,83.55 64.44,83.55 v64.98,83.01
TX2_ST3  (via drill 0.51)
  Top 0.254: v54.75,25.84 55.2,26.29 58.99,26.29 59.75,25.53 4TH_LAYER.2
  Bottom 0.254: U$1.9/CS 55.72,31.06 55.72,28.42 54.18,26.88 54.18,26.41 v54.75,25.84
TX3_ST1  (via drill 0.51)
  Top 0.254: v85.27,35.97 85.27,37.5 85.26,37.52 85.26,39.56 v91.17,45.47
  Bottom 0.254: v91.17,45.47 91.17,52.32 86.77,56.72 83.65,56.72 82.72,55.79 U$14.12 | v85.27,35.97 83.77,34.47 81.27,34.47 80.57,33.77 U$1.0/RX
TX_BT  (via drill 0.51)
  Top 0.254: v44.97,39.37 43.47,39.37 v42.67,40.17 | v37.57,40.37 29.17,40.37 27.23,38.43 U$1.31/A12
  Bottom 0.254: v44.97,39.37 45.28,39.37 48.62,36.03 48.62,32.61 47.54,31.53 47.5,31.53 45.98,30.01 BLUETOOTH.3 | v42.67,40.17 37.77,40.17 v37.57,40.37